# EAGLE design dyno_revA (EAGLE 9.6.2)
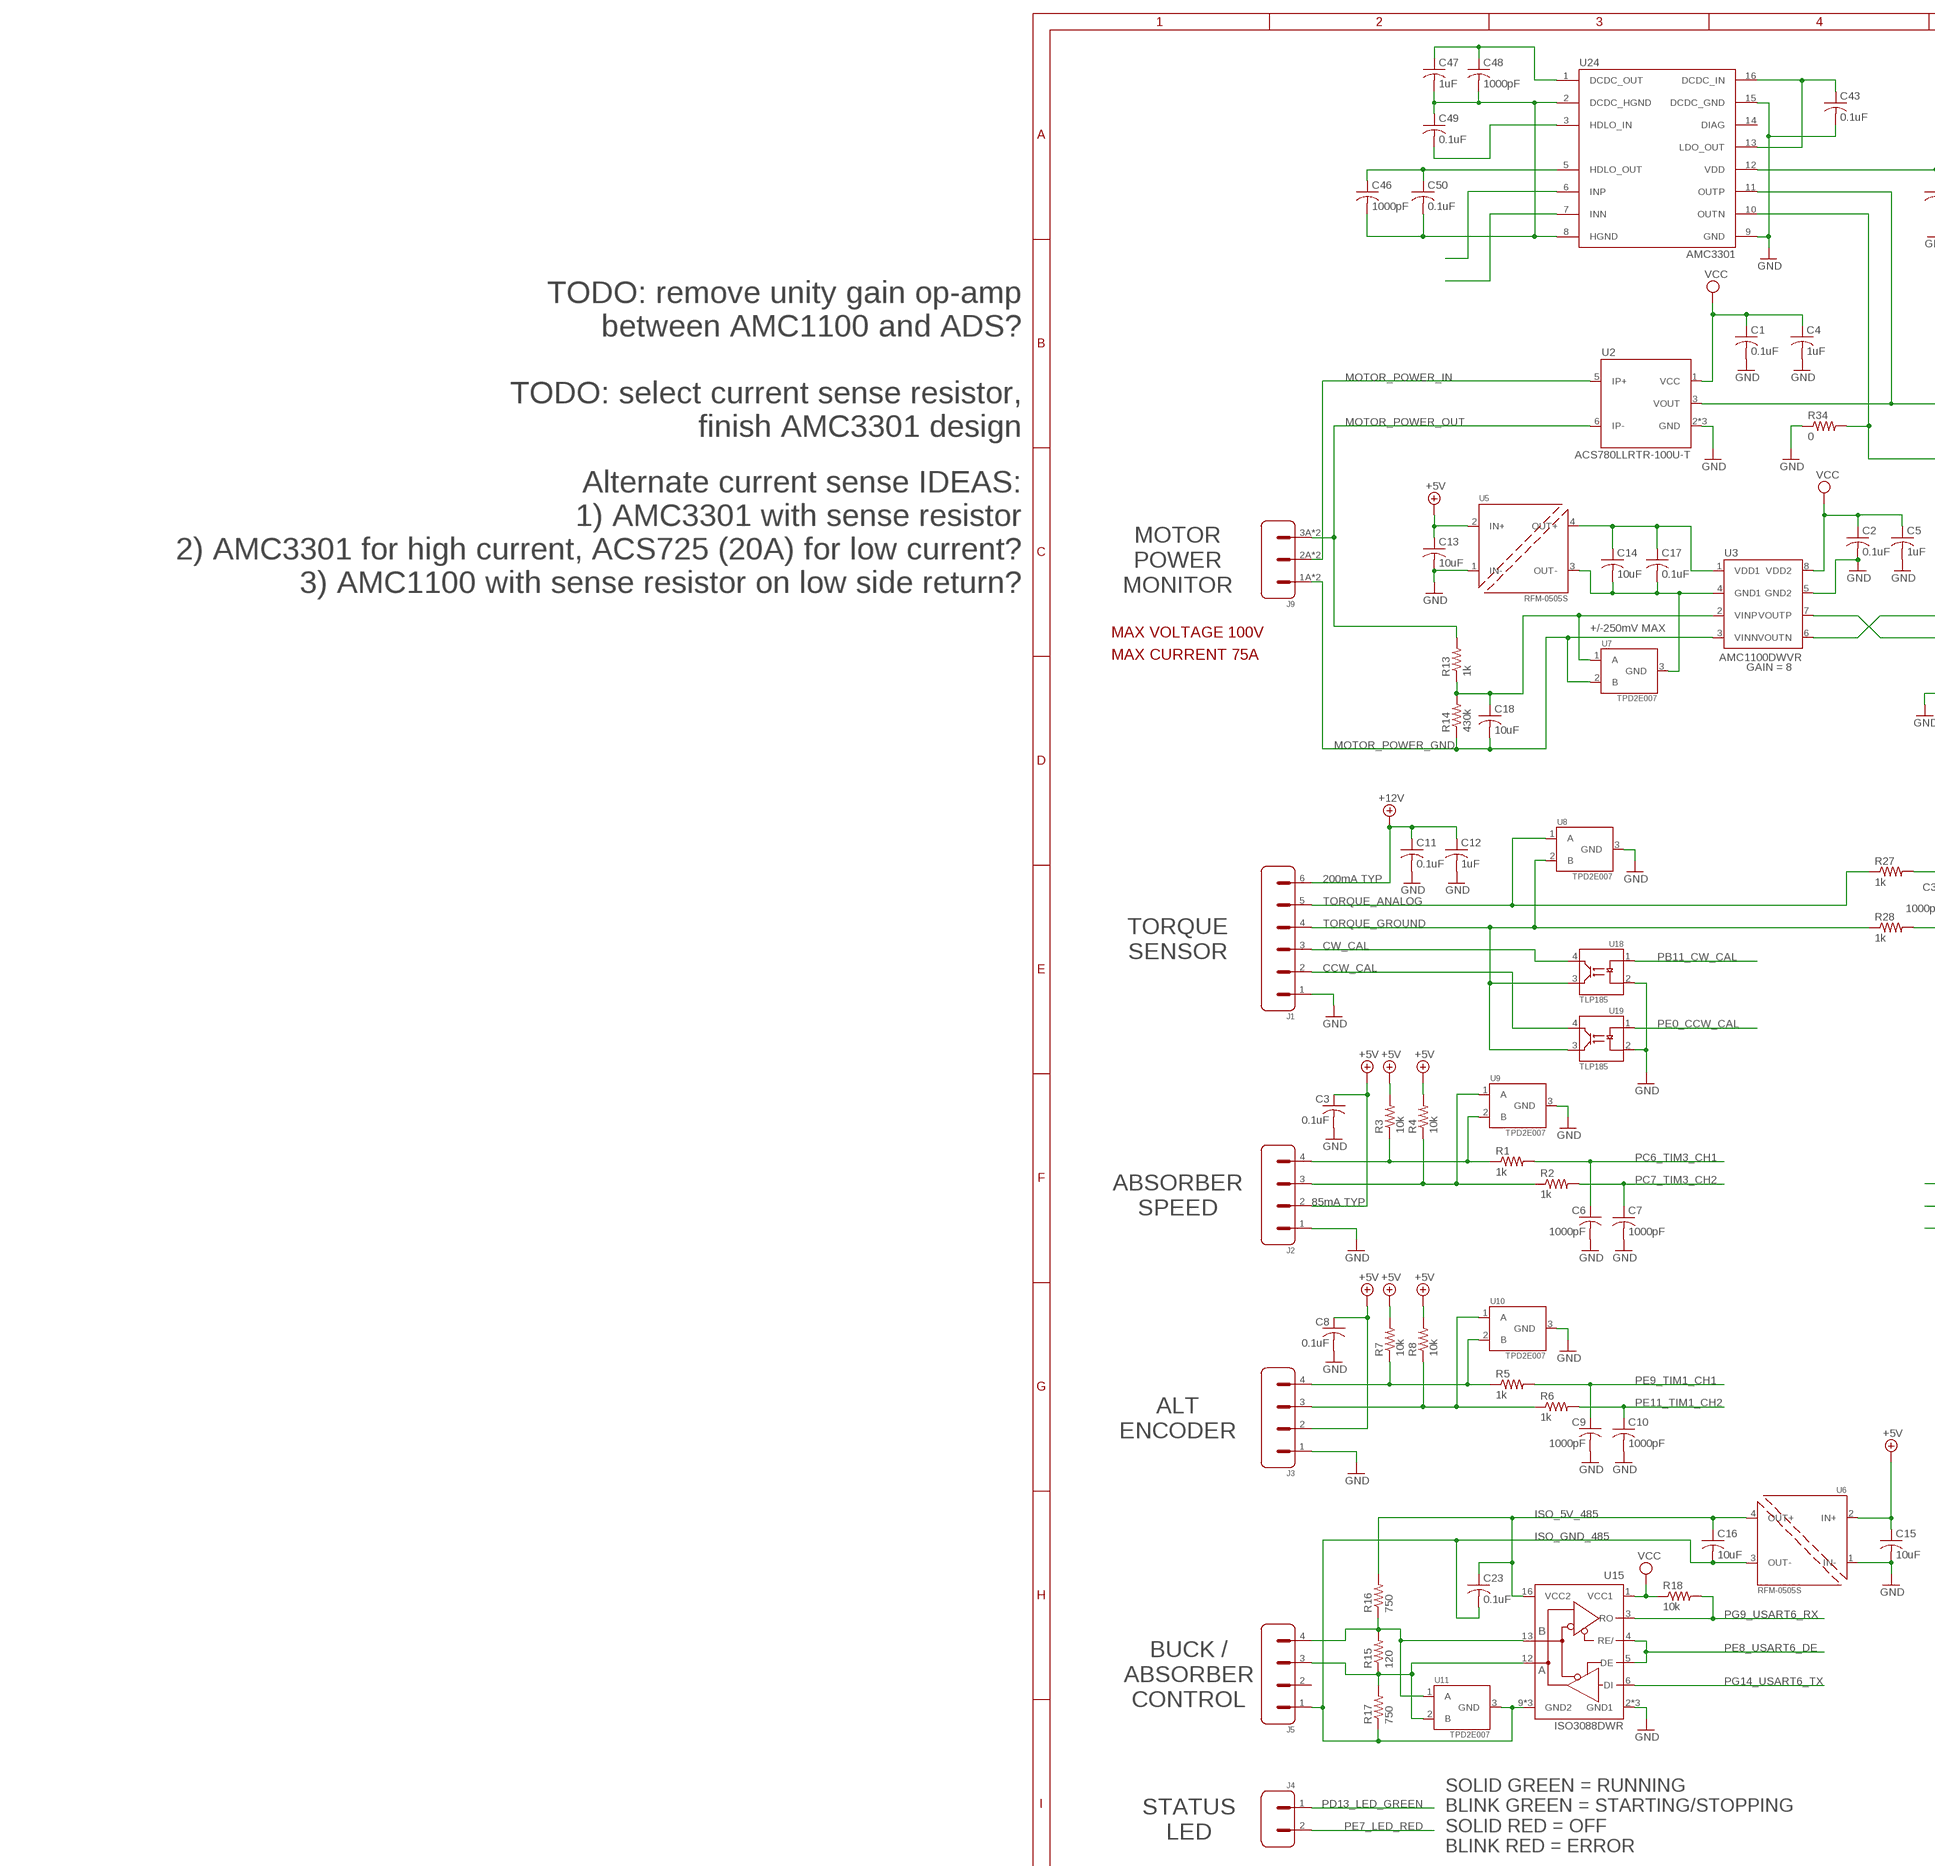
[diagram p0: schematic, sheet 1, part 1 of 2]
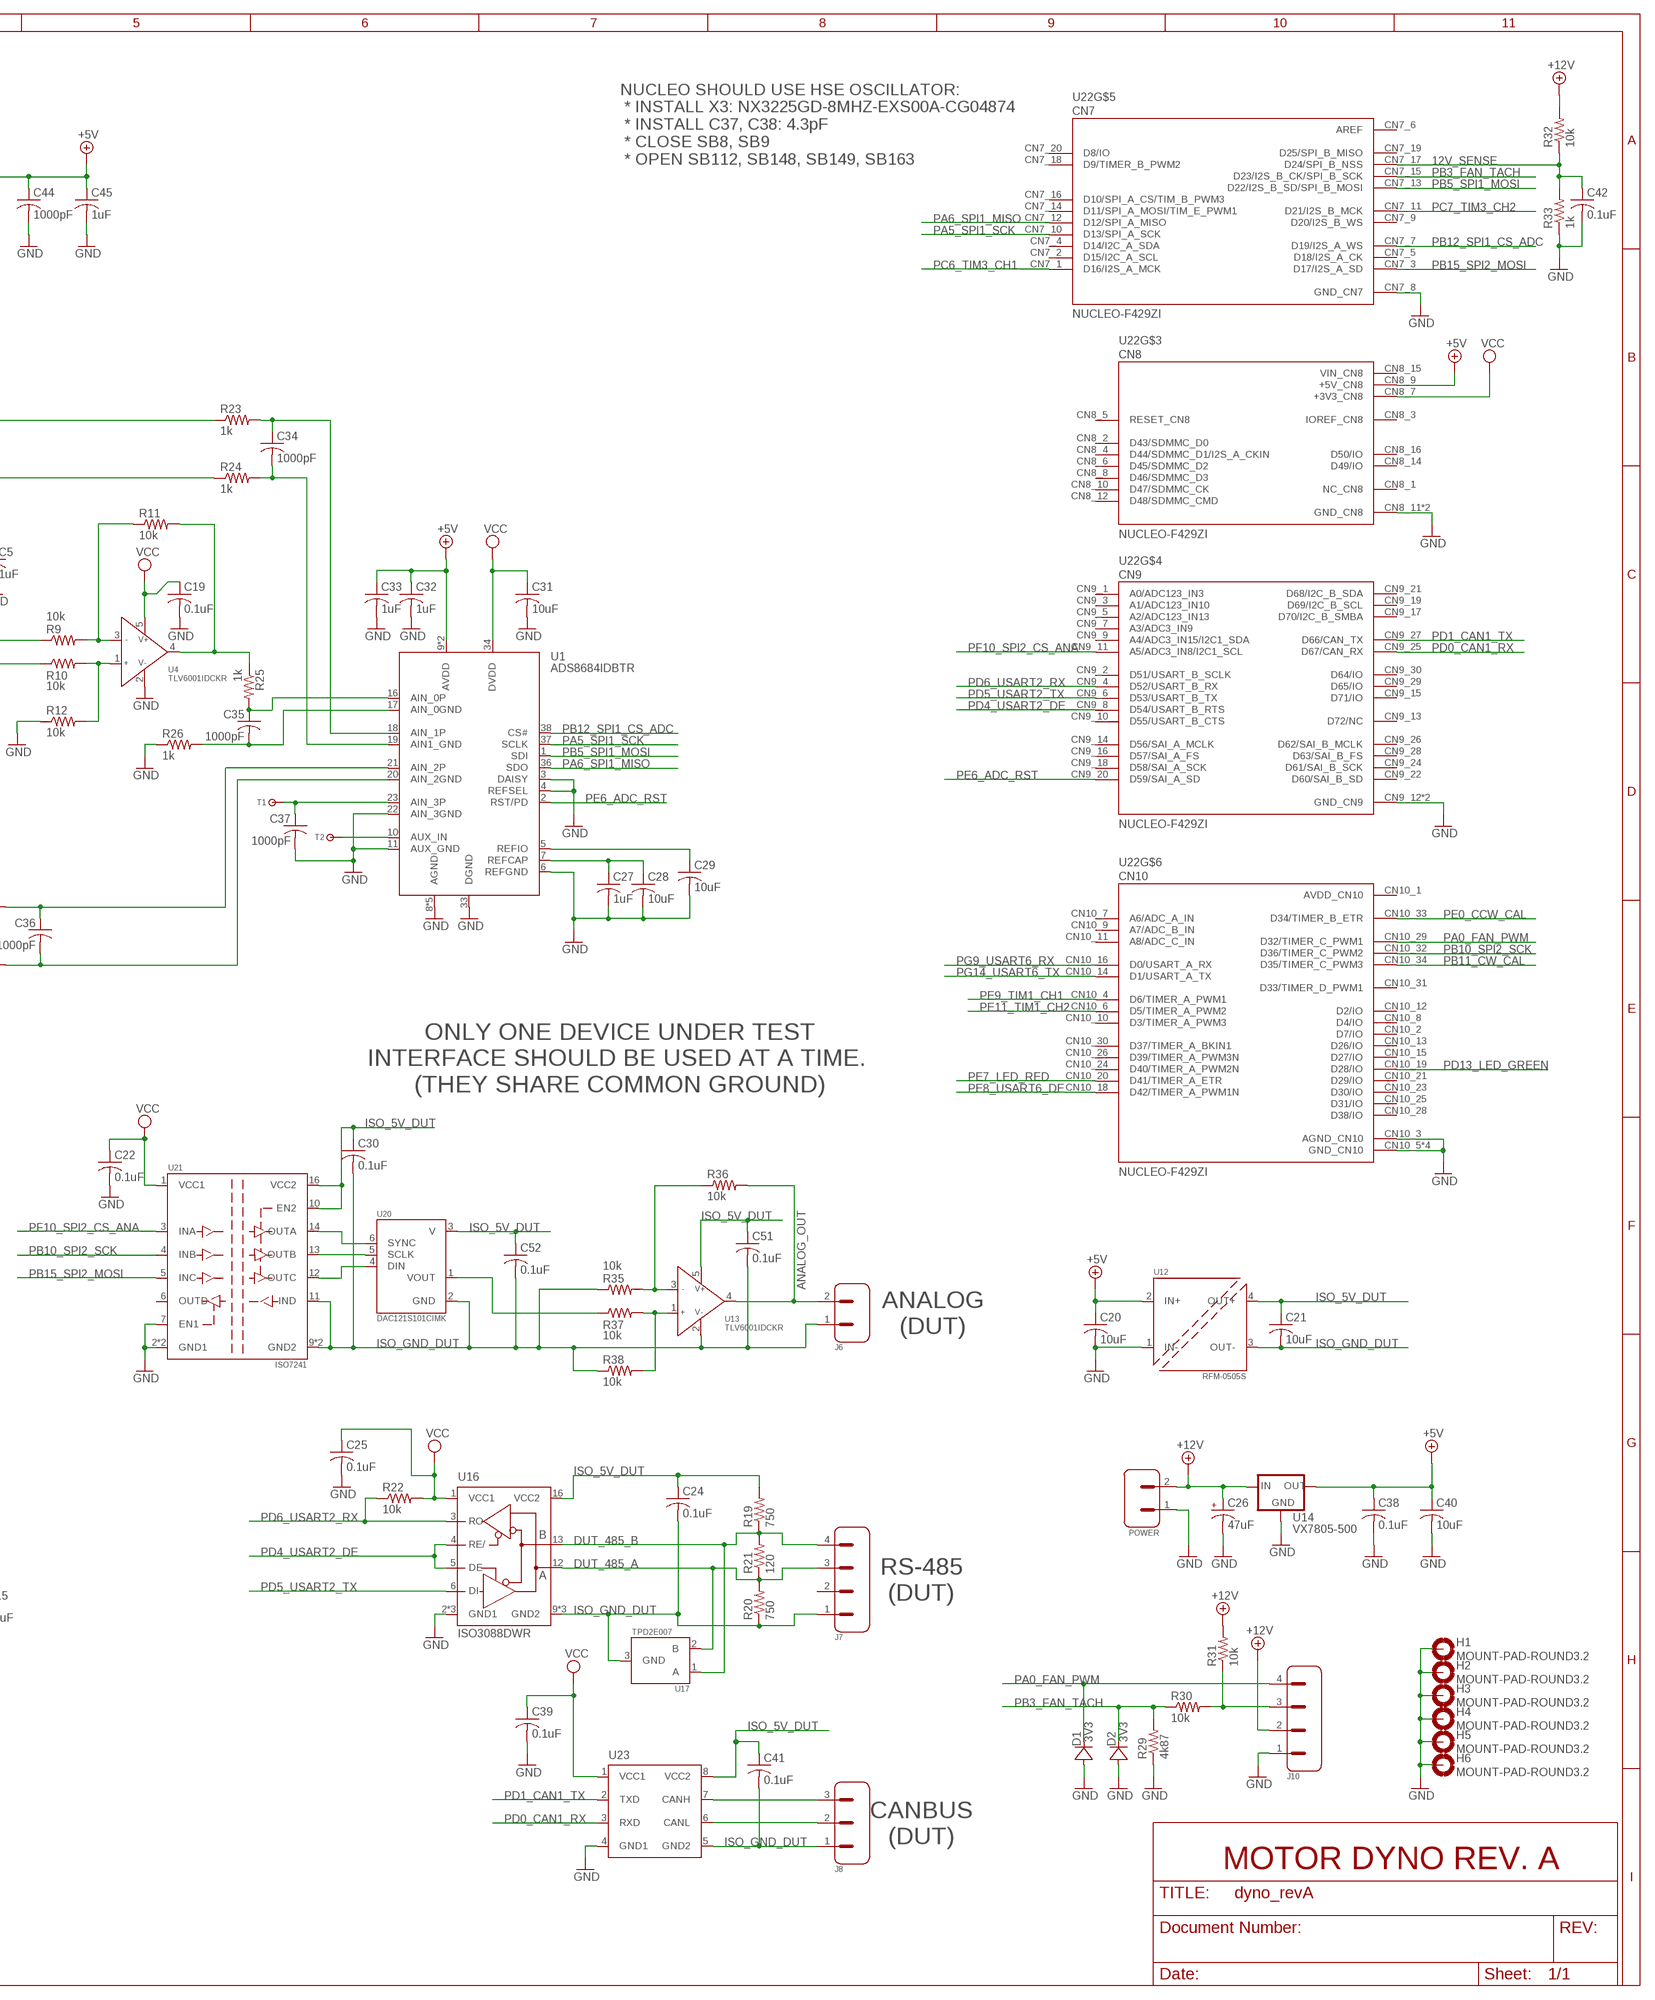
[diagram p1: schematic, sheet 1, part 2 of 2]

## Parts
C1  0.1uF  CL10B104KB8NNNC  [CAPC1608X90(C0603)]
C2  0.1uF  CL10B104KB8NNNC  [CAPC1608X90(C0603)]
C3  0.1uF  CL10B104KB8NNNC  [CAPC1608X90(C0603)]
C4  1uF  CL10A105KB8NNNC  [CAPC1608X90(C0603)]
C5  1uF  CL10A105KB8NNNC  [CAPC1608X90(C0603)]
C6  1000pF  CL10B102KB8NNNC  [CAPC1608X90(C0603)]
C7  1000pF  CL10B102KB8NNNC  [CAPC1608X90(C0603)]
C8  0.1uF  CL10B104KB8NNNC  [CAPC1608X90(C0603)]
C9  1000pF  CL10B102KB8NNNC  [CAPC1608X90(C0603)]
C10  1000pF  CL10B102KB8NNNC  [CAPC1608X90(C0603)]
C11  0.1uF  CL10B104KB8NNNC  [CAPC1608X90(C0603)]
C12  1uF  CL10A105KB8NNNC  [CAPC1608X90(C0603)]
C13  10uF  CL21A106KAYNNNE  [CAPC2012X145]
C14  10uF  CL21A106KAYNNNE  [CAPC2012X145]
C15  10uF  CL21A106KAYNNNE  [CAPC2012X145]
C16  10uF  CL21A106KAYNNNE  [CAPC2012X145]
C17  0.1uF  CL10B104KB8NNNC  [CAPC1608X90(C0603)]
C18  10uF  CL21A106KAYNNNE  [CAPC2012X145]
C19  0.1uF  CL10B104KB8NNNC  [CAPC1608X90(C0603)]
C20  10uF  CL21A106KAYNNNE  [CAPC2012X145]
C21  10uF  CL21A106KAYNNNE  [CAPC2012X145]
C22  0.1uF  CL10B104KB8NNNC  [CAPC1608X90(C0603)]
C23  0.1uF  CL10B104KB8NNNC  [CAPC1608X90(C0603)]
C24  0.1uF  CL10B104KB8NNNC  [CAPC1608X90(C0603)]
C25  0.1uF  CL10B104KB8NNNC  [CAPC1608X90(C0603)]
C26  47uF  HHXA500ARA470MHA0G  [CAPAE830X850(PANA_F)]
C27  1uF  CL10A105KB8NNNC  [CAPC1608X90(C0603)]
C28  10uF  CL10A106KQ8NNNC  [CAPC1608X90(C0603)]
C29  10uF  CL10A106KQ8NNNC  [CAPC1608X90(C0603)]
C30  0.1uF  CL10B104KB8NNNC  [CAPC1608X90(C0603)]
C31  10uF  CL10A106KQ8NNNC  [CAPC1608X90(C0603)]
C32  1uF  CL10A105KB8NNNC  [CAPC1608X90(C0603)]
C33  1uF  CL10A105KB8NNNC  [CAPC1608X90(C0603)]
C34  1000pF  CL10B102KB8NNNC  [CAPC1608X90(C0603)]
C35  1000pF  CL10B102KB8NNNC  [CAPC1608X90(C0603)]
C36  1000pF  CL10B102KB8NNNC  [CAPC1608X90(C0603)]
C37  1000pF  CL10B102KB8NNNC  [CAPC1608X90(C0603)]
C38  0.1uF  CL10B104KB8NNNC  [CAPC1608X90(C0603)]
C39  0.1uF  CL10B104KB8NNNC  [CAPC1608X90(C0603)]
C40  10uF  CL21A106KAYNNNE  [CAPC2012X145]
C41  0.1uF  CL10B104KB8NNNC  [CAPC1608X90(C0603)]
C42  0.1uF  CL10B104KB8NNNC  [CAPC1608X90(C0603)]
C43  0.1uF  CL10B104KB8NNNC  [CAPC1608X90(C0603)]
C44  1000pF  CL10B102KB8NNNC  [CAPC1608X90(C0603)]
C45  1uF  CL10A105KB8NNNC  [CAPC1608X90(C0603)]
C46  1000pF  CL10B102KB8NNNC  [CAPC1608X90(C0603)]
C47  1uF  CL10A105KB8NNNC  [CAPC1608X90(C0603)]
C48  1000pF  CL10B102KB8NNNC  [CAPC1608X90(C0603)]
C49  0.1uF  CL10B104KB8NNNC  [CAPC1608X90(C0603)]
C50  0.1uF  CL10B104KB8NNNC  [CAPC1608X90(C0603)]
C51  0.1uF  CL10B104KB8NNNC  [CAPC1608X90(C0603)]
C52  0.1uF  CL10B104KB8NNNC  [CAPC1608X90(C0603)]
D1  3V3  D1213A-01WS-7  [SOD2513X110(SOD323)]
D2  3V3  D1213A-01WS-7  [SOD2513X110(SOD323)]
H1  MOUNT-PAD-ROUND3.2  [3,2-PAD]
H2  MOUNT-PAD-ROUND3.2  [3,2-PAD]
H3  MOUNT-PAD-ROUND3.2  [3,2-PAD]
H4  MOUNT-PAD-ROUND3.2  [3,2-PAD]
H5  MOUNT-PAD-ROUND3.2  [3,2-PAD]
H6  MOUNT-PAD-ROUND3.2  [3,2-PAD]
J1  502584-0670  [502584-0670]
J2  502584-0470  [502584-0470]
J3  502584-0470  [502584-0470]
J4  502584-0270  [502584-0270]
J5  43650-0416  [43650-0416]
J6  502584-0270  [502584-0270]
J7  43650-0416  [43650-0416]
J8  43650-0316  [43650-0316]
J9  1017532  [1017532]
J10  22-23-2041  [22-23-2041]
POWER  39-29-0023  [5566-2]
R1  1k  ERJ-3EKF1001V  [RESC1608X55(ERJ-0603)]
R2  1k  ERJ-3EKF1001V  [RESC1608X55(ERJ-0603)]
R3  10k  ERJ-3EKF1002V  [RESC1608X55(ERJ-0603)]
R4  10k  ERJ-3EKF1002V  [RESC1608X55(ERJ-0603)]
R5  1k  ERJ-3EKF1001V  [RESC1608X55(ERJ-0603)]
R6  1k  ERJ-3EKF1001V  [RESC1608X55(ERJ-0603)]
R7  10k  ERJ-3EKF1002V  [RESC1608X55(ERJ-0603)]
R8  10k  ERJ-3EKF1002V  [RESC1608X55(ERJ-0603)]
R9  10k  ERJ-3EKF1002V  [RESC1608X55(ERJ-0603)]
R10  10k  ERJ-3EKF1002V  [RESC1608X55(ERJ-0603)]
R11  10k  ERJ-3EKF1002V  [RESC1608X55(ERJ-0603)]
R12  10k  ERJ-3EKF1002V  [RESC1608X55(ERJ-0603)]
R13  1k  ERJ-3EKF1001V  [RESC1608X55(ERJ-0603)]
R14  430k  ERJ-3EKF4303V  [RESC1608X55(ERJ-0603)]
R15  120  ERJ-3EKF1200V  [RESC1608X55(ERJ-0603)]
R16  750  ERJ-3EKF7500V  [RESC1608X55(ERJ-0603)]
R17  750  ERJ-3EKF7500V  [RESC1608X55(ERJ-0603)]
R18  10k  ERJ-3EKF1002V  [RESC1608X55(ERJ-0603)]
R19  750  ERJ-3EKF7500V  [RESC1608X55(ERJ-0603)]
R20  750  ERJ-3EKF7500V  [RESC1608X55(ERJ-0603)]
R21  120  ERJ-3EKF1200V  [RESC1608X55(ERJ-0603)]
R22  10k  ERJ-3EKF1002V  [RESC1608X55(ERJ-0603)]
R23  1k  ERJ-3EKF1001V  [RESC1608X55(ERJ-0603)]
R24  1k  ERJ-3EKF1001V  [RESC1608X55(ERJ-0603)]
R25  1k  ERJ-3EKF1001V  [RESC1608X55(ERJ-0603)]
R26  1k  ERJ-3EKF1001V  [RESC1608X55(ERJ-0603)]
R27  1k  ERJ-3EKF1001V  [RESC1608X55(ERJ-0603)]
R28  1k  ERJ-3EKF1001V  [RESC1608X55(ERJ-0603)]
R29  4k87  ERJ-3EKF4871V  [RESC1608X55(ERJ-0603)]
R30  10k  ERJ-3EKF1002V  [RESC1608X55(ERJ-0603)]
R31  10k  ERJ-3EKF1002V  [RESC1608X55(ERJ-0603)]
R32  10k  ERJ-3EKF1002V  [RESC1608X55(ERJ-0603)]
R33  1k  ERJ-3EKF1001V  [RESC1608X55(ERJ-0603)]
R34  0  ERJ-S030  [RESC1608X55(ERJ-0603)]
R35  10k  ERJ-3EKF1002V  [RESC1608X55(ERJ-0603)]
R36  10k  ERJ-3EKF1002V  [RESC1608X55(ERJ-0603)]
R37  10k  ERJ-3EKF1002V  [RESC1608X55(ERJ-0603)]
R38  10k  ERJ-3EKF1002V  [RESC1608X55(ERJ-0603)]
T1  TESTPAD  [TEST]
T2  TESTPAD  [TEST]
U1  ADS8684IDBTR  [SOP50P640X120-38]
U2  ACS780LLRTR-100U-T  [ACS780]
U3  AMC1100DWVR  [SOIC127P1150X280-8]
U4  TLV6001IDCKR  [SOT65P210X110-5]
U5  RFM-0505S  [RFM]
U6  RFM-0505S  [RFM]
U7  TPD2E007  [SOT65P210X110-3(SOT323)]
U8  TPD2E007  [SOT65P210X110-3(SOT323)]
U9  TPD2E007  [SOT65P210X110-3(SOT323)]
U10  TPD2E007  [SOT65P210X110-3(SOT323)]
U11  TPD2E007  [SOT65P210X110-3(SOT323)]
U12  RFM-0505S  [RFM]
U13  TLV6001IDCKR  [SOT65P210X110-5]
U14  VX7805-500  [VX78-500]
U15  ISO3088DWR  [SOIC127P1030X265-16]
U16  ISO3088DWR  [SOIC127P1030X265-16]
U17  TPD2E007  [SOT65P210X110-3(SOT323)]
U18  TLP185  [SOT127P700X220-4]
U19  TLP185  [SOT127P700X220-4]
U20  DAC121S101CIMK  [SOT95P280X110-6]
U21  ISO7241  [SOIC127P1030X265-16]
U22  NUCLEO-F429ZI  [MODULE_NUCLEO-F429ZI]
U23  ISO1042DWVR  [SOIC127P1150X265-8N]
U24  AMC3301  [SOIC127P1030X265-16N]

## Nets
12V_SENSE: C42.1 R32.1 R33.2 U22.CN7_17(D24/SPI_B_NSS)
+5V: C3.1 C8.1 C13.1 C15.1 C20.1 C32.1 C33.1 C38.1 C40.1 C44.1 C45.1 J2.2 J3.2 R3.2 R4.2 R7.2 R8.2 U1.9(AVDD) U1.30(AVDD) U5.2(IN+) U6.2(IN+) U12.2(IN+) U14.3(OUT) U22.CN8_9(+5V_CN8) U24.12(VDD)
+12V: C11.1 C12.1 C26.1(+) J1.6 J10.2 POWER.2 R31.2 R32.2 U14.1(IN)
ABSORBER_485_A: J5.3 R15.1 R17.2 U11.2(B) U15.12(A)
ABSORBER_485_B: J5.4 R15.2 R16.1 U11.1(A) U15.13(B)
AIN_3P: C37.1 T1.T U1.23(AIN_3P)
ANALOG_OUT: J6.2 R36.2 U13.4(OUT)
AUX_IN: T2.T U1.10(AUX_IN)
CANH: J8.3 U23.7(CANH)
CANL: J8.2 U23.6(CANL)
CCW_CAL: J1.2 U19.4(COLL)
CW_CAL: J1.3 U18.4(COLL)
DUT_485_A: J7.3 R20.2 R21.1 U16.12(A) U17.2(B)
DUT_485_B: J7.4 R19.1 R21.2 U16.13(B) U17.1(A)
ENC_A: J3.4 R5.1 R7.1 U10.2(B)
ENC_B: J3.3 R6.1 R8.1 U10.1(A)
GND: C1.2 C2.2 C3.2 C4.2 C5.2 C6.2 C7.2 C8.2 C9.2 C10.2 C11.2 C12.2 C13.2 C15.2 C19.2 C20.2 C22.2 C25.2 C26.2(-) C27.2 C28.2 C29.2 C31.2 C32.2 C33.2 C37.2 C38.2 C39.2 C40.2 C42.2 C43.2 C44.2 C45.2 D1.2(A) D2.2(A) H1.B3,2(MOUNT) H2.B3,2(MOUNT) H3.B3,2(MOUNT) H4.B3,2(MOUNT) H5.B3,2(MOUNT) H6.B3,2(MOUNT) J1.1 J2.1 J3.1 J10.1 POWER.1 R12.1 R26.1 R29.1 R33.1 R34.1 U1.3(DAISY) U1.4(REFSEL) U1.6(REFGND) U1.8(AGND) U1.11(AUX_GND) U1.22(AIN_3GND) U1.28(AGND) U1.29(AGND) U1.31(AGND) U1.32(AGND) U1.33(DGND) U2.2(GND) U2.4(GND) U2.7(GND) U3.5(GND2) U4.2(V-) U5.1(IN-) U6.1(IN-) U8.3(GND) U9.3(GND) U10.3(GND) U12.1(IN-) U14.2(GND) U15.2(GND1) U15.7(GND1) U15.8(GND1) U16.2(GND1) U16.7(GND1) U16.8(GND1) U18.2(C) U19.2(C) U21.2(GND1) U21.7(EN1) U21.8(GND1) U22.CN7_8(GND_CN7) U22.CN8_11(GND_CN8) U22.CN8_13(GND_CN8) U22.CN9_12(GND_CN9) U22.CN9_23(GND_CN9) U22.CN10_3(AGND_CN10) U22.CN10_5(GND_CN10) U22.CN10_17(GND_CN10) U22.CN10_22(GND_CN10) U22.CN10_27(GND_CN10) U23.4(GND1) U24.9(GND) U24.15(DCDC_GND)
ISENSE_OUT: R23.1 U2.3(VOUT) U24.11(OUTP)
ISO_5V_485: C16.1 C23.1 R16.2 U6.4(OUT+) U15.16(VCC2)
ISO_5V_DUT: C21.1 C24.1 C30.1 C41.1 C51.1 C52.1 R19.2 U12.4(OUT+) U13.5(V+) U16.16(VCC2) U20.3(V) U21.10(EN2) U21.16(VCC2) U23.8(VCC2)
ISO_5V_M: C14.1 C17.1 U3.1(VDD1) U5.4(OUT+)
ISO_GND_485: C16.2 C23.2 J5.1 R17.1 U6.3(OUT-) U11.3(GND) U15.9(GND2) U15.10(GND2) U15.15(GND2)
ISO_GND_DUT: C21.2 C24.2 C30.2 C41.2 C51.2 C52.2 J6.1 J7.1 J8.1 R20.1 R35.1 R38.1 U12.3(OUT-) U13.2(V-) U16.9(GND2) U16.10(GND2) U16.15(GND2) U17.3(GND) U20.2(GND) U21.9(GND2) U21.11(IND) U21.15(GND2) U23.5(GND2)
ISO_GND_M: C14.2 C17.2 U3.4(GND1) U5.3(OUT-) U7.3(GND)
MOTOR_POWER_GND: C18.2 J9.1A J9.1B R14.1 U3.3(VINN) U7.2(B)
MOTOR_POWER_IN: J9.2A J9.2B U2.5(IP+)
MOTOR_POWER_OUT: J9.3A J9.3B R13.2 U2.6(IP-)
N$1: J10.3 R30.2 R31.1
N$2: C43.1 U24.13(LDO_OUT) U24.16(DCDC_IN)
N$3: R10.2 R12.2 U4.1(+)
N$4: R9.2 R11.1 U4.3(-)
N$5: R24.1 R34.2 U24.10(OUTN)
N$6: C35.2 R26.2 U1.17(AIN_0GND)
N$7: U24.6(INP)
N$8: U24.7(INN)
N$9: C35.1 R25.2 U1.16(AIN_0P)
N$10: R10.1 U3.7(VOUTP)
N$11: R37.1 U20.1(VOUT)
N$12: U20.6(SYNC) U21.14(OUTA)
N$13: U20.5(SCLK) U21.13(OUTB)
N$14: U20.4(DIN) U21.12(OUTC)
N$15: R9.1 U3.6(VOUTN)
N$16: C34.1 R23.2 U1.18(AIN_1P)
N$17: C34.2 R24.2 U1.19(AIN1_GND)
N$18: C46.1 C50.1 U24.5(HDLO_OUT)
N$19: C46.2 C47.2 C48.2 C49.1 C50.2 U24.2(DCDC_HGND) U24.8(HGND)
N$20: C47.1 C48.1 U24.1(DCDC_OUT)
N$21: C49.2 U24.3(HDLO_IN)
N$22: R37.2 R38.2 U13.1(+)
N$23: R35.2 R36.1 U13.3(-)
PA0_FAN_PWM: D1.1(C) J10.4 U22.CN10_29(D32/TIMER_C_PWM1)
PA5_SPI1_SCK: U1.37(SCLK) U22.CN7_10(D13/SPI_A_SCK)
PA6_SPI1_MISO: U1.36(SDO) U22.CN7_12(D12/SPI_A_MISO)
PB3_FAN_TACH: D2.1(C) R29.2 R30.1 U22.CN7_15(D23/I2S_B_CK/SPI_B_SCK)
PB5_SPI1_MOSI: U1.1(SDI) U22.CN7_13(D22/I2S_B_SD/SPI_B_MOSI)
PB10_SPI2_SCK: U21.4(INB) U22.CN10_32(D36/TIMER_C_PWM2)
PB11_CW_CAL: U18.1(A) U22.CN10_34(D35/TIMER_C_PWM3)
PB12_SPI1_CS_ADC: U1.38(CS#) U22.CN7_7(D19/I2S_A_WS)
PB15_SPI2_MOSI: U21.5(INC) U22.CN7_3(D17/I2S_A_SD)
PC6_TIM3_CH1: C6.1 R1.2 U22.CN7_1(D16/I2S_A_MCK)
PC7_TIM3_CH2: C7.1 R2.2 U22.CN7_11(D21/I2S_B_MCK)
PD0_CAN1_RX: U22.CN9_25(D67/CAN_RX) U23.3(RXD)
PD1_CAN1_TX: U22.CN9_27(D66/CAN_TX) U23.2(TXD)
PD4_USART2_DE: U16.4(RE/) U16.5(DE) U22.CN9_8(D54/USART_B_RTS)
PD5_USART2_TX: U16.6(DI) U22.CN9_6(D53/USART_B_TX)
PD6_USART2_RX: R22.1 U16.3(RO) U22.CN9_4(D52/USART_B_RX)
PD13_LED_GREEN: J4.1 U22.CN10_19(D28/IO)
PE0_CCW_CAL: U19.1(A) U22.CN10_33(D34/TIMER_B_ETR)
PE6_ADC_RST: U1.2(RST/PD) U22.CN9_20(D59/SAI_A_SD)
PE7_LED_RED: J4.2 U22.CN10_20(D41/TIMER_A_ETR)
PE8_USART6_DE: U15.4(RE/) U15.5(DE) U22.CN10_18(D42/TIMER_A_PWM1N)
PE9_TIM1_CH1: C9.1 R5.2 U22.CN10_4(D6/TIMER_A_PWM1)
PE11_TIM1_CH2: C10.1 R6.2 U22.CN10_6(D5/TIMER_A_PWM2)
PF10_SPI2_CS_ANA: U21.3(INA) U22.CN9_11(A5/ADC3_IN8/I2C1_SCL)
PG9_USART6_RX: R18.2 U15.3(RO) U22.CN10_16(D0/USART_A_RX)
PG14_USART6_TX: U15.6(DI) U22.CN10_14(D1/USART_A_TX)
REFCAP: C27.1 C28.1 U1.7(REFCAP)
REFIO: C29.1 U1.5(REFIO)
SENSE_VOLTAGE: C18.1 R13.1 R14.2 U3.2(VINP) U7.1(A)
SPEED_A: J2.4 R1.1 R3.1 U9.2(B)
SPEED_B: J2.3 R2.1 R4.1 U9.1(A)
TAF: C36.1 R27.2 U1.21(AIN_2P)
TGF: C36.2 R28.2 U1.20(AIN_2GND)
TORQUE_ANALOG: J1.5 R27.1 U8.1(A)
TORQUE_GROUND: J1.4 R28.1 U8.2(B) U18.3(EMIT) U19.3(EMIT)
VCC: C1.1 C2.1 C4.1 C5.1 C19.1 C22.1 C25.1 C31.1 C39.1 R18.1 R22.2 U1.34(DVDD) U2.1(VCC) U3.8(VDD2) U4.5(V+) U15.1(VCC1) U16.1(VCC1) U21.1(VCC1) U22.CN8_7(+3V3_CN8) U23.1(VCC1)
VSENSE_OUT: R11.2 R25.1 U4.4(OUT)
Unconnected: J5.2 J7.2 U21.6(OUTD) U22.CN7_2(D15/I2C_A_SCL) U22.CN7_4(D14/I2C_A_SDA) U22.CN7_5(D18/I2S_A_CK) U22.CN7_9(D20/I2S_B_WS) U22.CN7_14(D11/SPI_A_MOSI/TIM_E_PWM1) U22.CN7_16(D10/SPI_A_CS/TIM_B_PWM3) U22.CN7_18(D9/TIMER_B_PWM2) U22.CN7_19(D25/SPI_B_MISO) U22.CN7_20(D8/IO) U22.CN8_1(NC_CN8) U22.CN8_2(D43/SDMMC_D0) U22.CN8_3(IOREF_CN8) U22.CN8_4(D44/SDMMC_D1/I2S_A_CKIN) U22.CN8_5(RESET_CN8) U22.CN8_6(D45/SDMMC_D2) U22.CN8_8(D46/SDMMC_D3) U22.CN8_10(D47/SDMMC_CK) U22.CN8_12(D48/SDMMC_CMD) U22.CN8_14(D49/IO) U22.CN8_16(D50/IO) U22.CN9_1(A0/ADC123_IN3) U22.CN9_2(D51/USART_B_SCLK) U22.CN9_3(A1/ADC123_IN10) U22.CN9_5(A2/ADC123_IN13) U22.CN9_7(A3/ADC3_IN9) U22.CN9_9(A4/ADC3_IN15/I2C1_SDA) U22.CN9_10(D55/USART_B_CTS) U22.CN9_13(D72/NC) U22.CN9_14(D56/SAI_A_MCLK) U22.CN9_15(D71/IO) U22.CN9_16(D57/SAI_A_FS) U22.CN9_17(D70/I2C_B_SMBA) U22.CN9_18(D58/SAI_A_SCK) U22.CN9_19(D69/I2C_B_SCL) U22.CN9_21(D68/I2C_B_SDA) U22.CN9_22(D60/SAI_B_SD) U22.CN9_24(D61/SAI_B_SCK) U22.CN9_26(D62/SAI_B_MCLK) U22.CN9_28(D63/SAI_B_FS) U22.CN9_29(D65/IO) U22.CN9_30(D64/IO) U22.CN10_2(D7/IO) U22.CN10_7(A6/ADC_A_IN) U22.CN10_8(D4/IO) U22.CN10_9(A7/ADC_B_IN) U22.CN10_10(D3/TIMER_A_PWM3) U22.CN10_11(A8/ADC_C_IN) U22.CN10_12(D2/IO) U22.CN10_13(D26/IO) U22.CN10_15(D27/IO) U22.CN10_21(D29/IO) U22.CN10_23(D30/IO) U22.CN10_24(D40/TIMER_A_PWM2N) U22.CN10_25(D31/IO) U22.CN10_26(D39/TIMER_A_PWM3N) U22.CN10_28(D38/IO) U22.CN10_30(D37/TIMER_A_BKIN1) U22.CN10_31(D33/TIMER_D_PWM1) U24.14(DIAG)

## Notes on the sheet
- NUCLEO SHOULD USE HSE OSCILLATOR:
   * INSTALL X3: NX3225GD-8MHZ-EXS00A-CG04874
   * INSTALL C37, C38: 4.3pF
   * CLOSE SB8, SB9
   * OPEN SB112, SB148, SB149, SB163
- TODO: remove unity gain op-amp
  between AMC1100 and ADS?
- TODO: select current sense resistor,
  finish AMC3301 design
- Alternate current sense IDEAS:
  1) AMC3301 with sense resistor
  2) AMC3301 for high current, ACS725 (20A) for low current?
  3) AMC1100 with sense resistor on low side return?
- MOTOR
  POWER
  MONITOR
- +/-250mV MAX
- MAX VOLTAGE 100V
- MAX CURRENT 75A
- GAIN = 8
- 200mA TYP
- TORQUE
  SENSOR
- ONLY ONE DEVICE UNDER TEST
  INTERFACE SHOULD BE USED AT A TIME. 
  (THEY SHARE COMMON GROUND)
- ABSORBER
  SPEED
- 85mA TYP
- ANALOG
  (DUT)
- ALT
  ENCODER
- RS-485
  (DUT)
- BUCK /
  ABSORBER
  CONTROL
- CANBUS
  (DUT)
- MOTOR DYNO REV. A
- STATUS
  LED
- SOLID GREEN = RUNNING
  BLINK GREEN = STARTING/STOPPING
  SOLID RED = OFF
  BLINK RED = ERROR

## Power pins joined to a net without a drawn wire
AREF: U22.CN7_6(AREF)
AVDD_CN10: U22.CN10_1(AVDD_CN10)
VIN_CN8: U22.CN8_15(VIN_CN8)

## Library data of the parts
C1-C3 C6-C11 C17 C19 C22-C25 C30 C34-C39 C41-C44 C46 C48-C52 = botnuvo:CL10: CAP CER, 0603; GRADE: X7R; VOLTAGE: 50V
C4 C5 C12 C27 C32 C33 C45 C47 = botnuvo:CL10: CAP CER, 0603; GRADE: X5R; VOLTAGE: 50V
C13-C16 C18 C20 C21 C40 = botnuvo:CL21: CAP CER, 0805; GRADE: X5R; VOLTAGE: 25V
C26 = botnuvo:HHXA500ARA470MHA0G: CAP ALUM POLY HYB 47UF 50V SMD TESTED: NO (NEW 3D FOOTPRINT)
C28 C29 C31 = botnuvo:CL10: CAP CER, 0603; GRADE: X5R; VOLTAGE: 6.3V
D1 D2 = botnuvo:D1213A-01WS-7: TVS DIODE 3.3V 10V SOD323 TESTED: NO
H1-H6 = holes:MOUNT-PAD-ROUND: MOUNTING PAD, round
J1 = botnuvo:502584-0670: CLIK-MATE HEADER VERT 6POS 1.50MM TESTED: YES
J2 J3 = botnuvo:502584-0470: CLIK-MATE HEADER VERT 4POS 1.50MM TESTED: NO
J4 J6 = botnuvo:502584-0270: CLIK-MATE HEADER VERT 2POS 1.50MM TESTED: NO
J5 J7 = botnuvo:43650-0416: MICROFIT HEADER 4POS 3MM VERT GOLD TESTED: YES
J8 = botnuvo:43650-0316: MICROFIT HEADER 3POS 3MM VERT GOLD TESTED: NO
J9 = botnuvo:1017532: TERMINAL BLOCK, 3P 600V, 58A, 6-20AWG TESTED: NO
J10 = botnuvo:22-23-2041: KK HEADER VERT 4POS 2.54MM TESTED: NO
POWER = botnuvo:39-29-0023: MINIFIT JR HEADER 2POS VERT GOLD TESTED: NO
R1-R33 R35-R38 = botnuvo:ERJ-3EKF: RES SMD OHM 1% 1/10W 0603
R34 = botnuvo:ERJ-S030
T1 T2 = fergs:TESTPAD
U1 = botnuvo:ADS8684: IC ADC 16BIT 500KSPS 38TSSOP
U2 = botnuvo:ACS780: CURRENT SENSOR
U3 = botnuvo:AMC1100: IC OPAMP ISOLATION 100KHZ 8SOIC
U4 U13 = botnuvo:TLV6001: IC OP AMP RR 1MHZ SC70-5
U5 U6 U12 = botnuvo:RFM-0505S: DC DC CONVERTER 5V 1W (ISOLATED)
U7-U11 U17 = botnuvo:TPD2E007: 2 CHANNEL ESD PROTECTION
U14 = botnuvo:VX780: SWITCHING REGULATOR; CURRENT: 500mA; VIN: 6.5-36V; VOUT: 5V
U15 U16 = botnuvo:ISO3088: IC ISOLATED RS422/RS485 16SOIC
U18 U19 = botnuvo:TLP185: OPTOISO 3.75KV TRANS 6-SO 4 LEAD
U20 = botnuvo:DAC121: IC DAC 12BIT MICROPWR 6SOT
U21 = botnuvo:ISO7241: IC ISOLATOR 2.5KV 3OUT/1IN 16SOIC
U22 = NUCLEO-F429ZI:NUCLEO-F429ZI: STM32F429ZI, mbed-Enabled Development Nucleo-144 STM32F4 ARM® Cortex®-M4 MCU 32-Bit Embedded Evaluation Board Check prices <https://pricing.snapeda.com/parts/NUCLEO-F429ZI/STMicroelectronics/view-part?ref=eda>; AVAILABILITY: Warning; DESCRIPTION: STM32F429ZI, mbed-Enabled Development Nucleo-144 STM32F4 ARM® Cortex®-M4 MCU 32-Bit Embedded Evaluation Board; MF: STMicroelectronics; MP: NUCLEO-F429ZI; PACKAGE: None; PRICE: None; PURCHASE-URL: https://pricing.snapeda.com/search/part/NUCLEO-F429ZI/?ref=eda
U23 = botnuvo:ISO1042: ISOLATED CAN, 8SOIC TESTED: NO
U24 = botnuvo:AMC3301

## Board
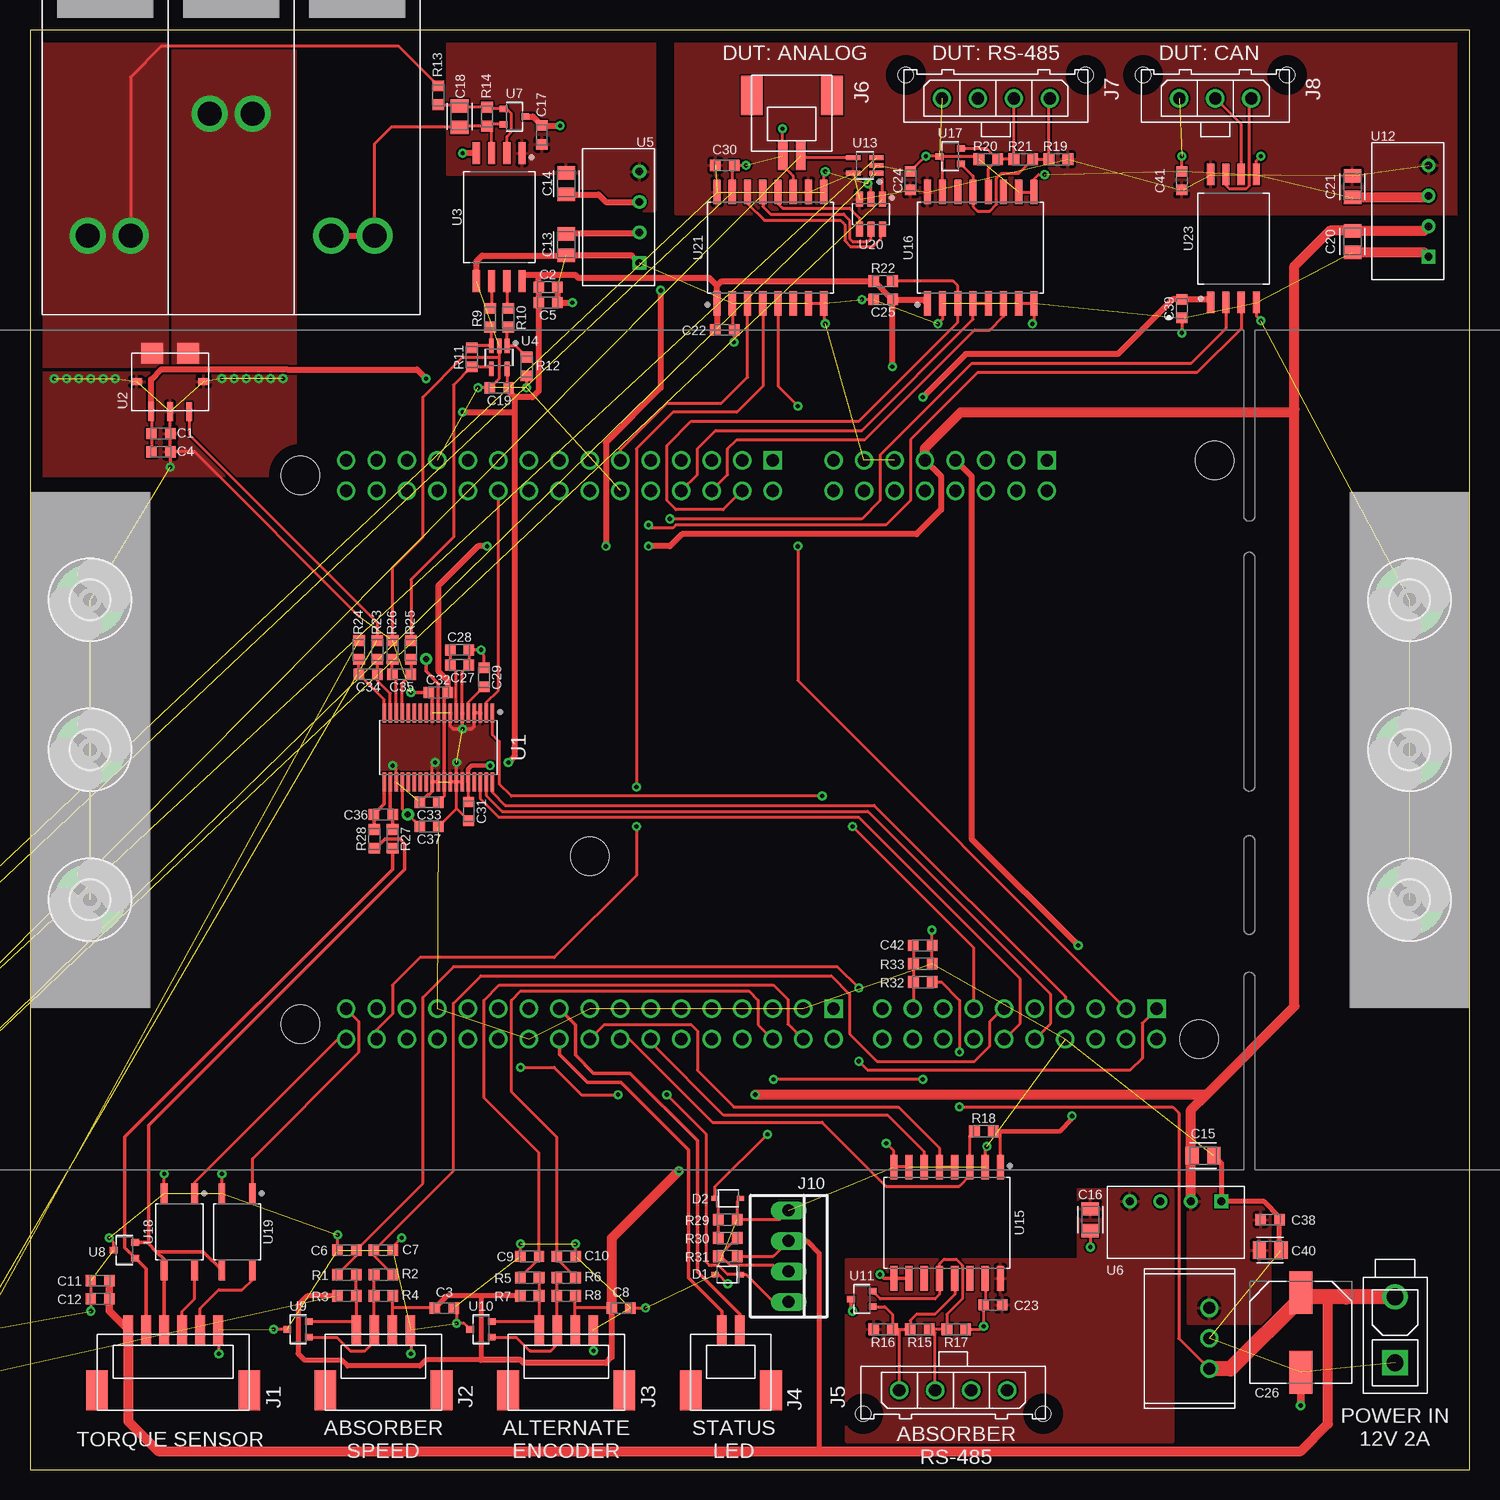
[diagram p2: board, top side]
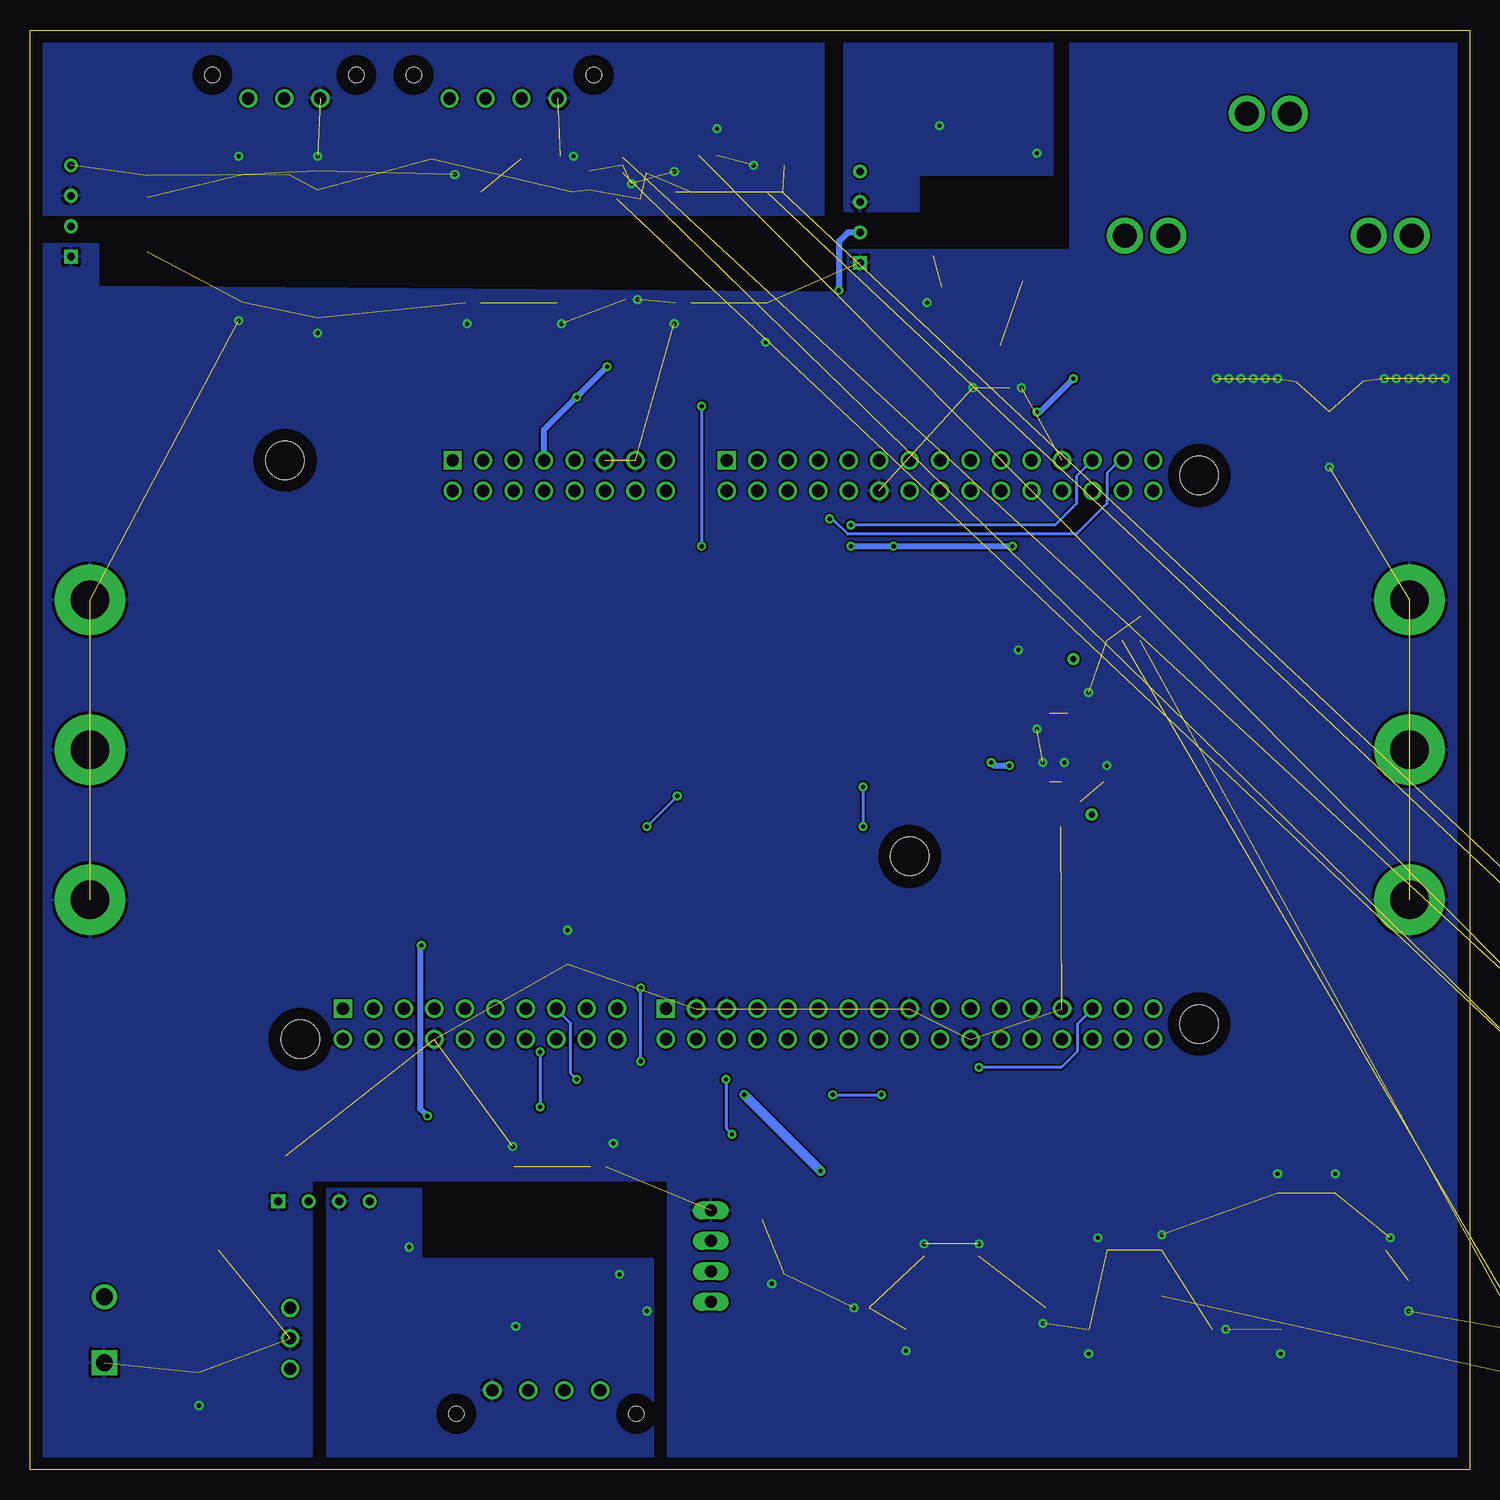
[diagram p3: board, bottom side, seen from below]

Size 120 x 120 mm. Coordinates in mm from the lower left corner, seen from the top.
Outline: 0,0 120,0 120,120 0,120 0,0
Copper layers (1*16): Top 0.035mm / dielectric 1.5mm / Bottom 0.035mm
Design rules "default": minimum track width 6mil, minimum drill 0.35mm, track to track 6mil, track to pad 6mil, pad to pad 6mil, via to via 6mil, smd to smd 6mil, copper to edge 40mil, drill to drill 6mil, minimum pad ring 10mil, minimum via ring 8mil, stop-mask expansion 4mil, vias tented up to drill 0mil, thermal gap 10mil

### Footprints (pad centres in the part's own frame; a part is rotated, then mirrored left to right if it is on the bottom)
CAPC1608X90(C0603) = smd 0.87 x 0.929: 1 -0.78,0; 2 0.78,0
CAPC2012X145 = smd 1.115 x 1.465: 1 -0.9,0; 2 0.9,0
CAPAE830X850(PANA_F) = smd 3.565 x 1.915: 1 -3.325,0; 2 3.325,0
SOD2513X110(SOD323) = smd 0.59 x 0.45: 1 -1.05,0; 2 1.05,0
3,2-PAD = drill 3.2 pad 5.842: B3,2 0,0
502584-0670 = smd 0.8 x 2.4: 1 3.75,5.05; 2 2.25,5.05; 3 0.75,5.05; 4 -0.75,5.05; 5 -2.25,5.05; 6 -3.75,5.05 | smd 1.8 x 3.3: P$5 -6.35,0; P$6 6.35,0
502584-0470 = smd 0.8 x 2.4: 1 2.25,5.05; 2 0.75,5.05; 3 -0.75,5.05; 4 -2.25,5.05 | smd 1.8 x 3.3: P$5 -4.85,0; P$6 4.85,0
502584-0270 = smd 0.8 x 2.4: 1 0.75,5.05; 2 -0.75,5.05 | smd 1.8 x 3.3: P$5 -3.35,0; P$6 3.35,0
43650-0416 = drill 1.02: 1 4.5,0; 2 1.5,0; 3 -1.5,0; 4 -4.5,0 | hole 1.27: -7.5,-1.96; 7.5,-1.96
43650-0316 = drill 1.02: 1 3,0; 2 0,0; 3 -3,0 | hole 1.27: -6,-1.96; 6,-1.96
1017532 = drill 2: 1A 11.96,-10.16; 1B 8.36,-10.16; 2A 1.8,0; 2B -1.8,0; 3A -8.36,-10.16; 3B -11.96,-10.16
22-23-2041 = drill 1 long: 1 -3.81,0; 2 -1.27,0; 3 1.27,0; 4 3.81,0
5566-2 = drill 1.397 square: 1 0,0 | drill 1.397: 2 0,5.5
RESC1608X55(ERJ-0603) = smd 0.9 x 0.979: 1 -0.785,0; 2 0.785,0
TEST = drill 0.508: T 0,0
SOP50P640X120-38 = smd 1.572 x 0.28: 1 -2.872,4.5; 2 -2.872,4; 3 -2.872,3.5; 4 -2.872,3; 5 -2.872,2.5; 6 -2.872,2; 7 -2.872,1.5; 8 -2.872,1; 9 -2.872,0.5; 10 -2.872,0; 11 -2.872,-0.5; 12 -2.872,-1; 13 -2.872,-1.5; 14 -2.872,-2; 15 -2.872,-2.5; 16 -2.872,-3; 17 -2.872,-3.5; 18 -2.872,-4; 19 -2.872,-4.5; 20 2.872,-4.5; 21 2.872,-4; 22 2.872,-3.5; 23 2.872,-3; 24 2.872,-2.5; 25 2.872,-2; 26 2.872,-1.5; 27 2.872,-1; 28 2.872,-0.5; 29 2.872,0; 30 2.872,0.5; 31 2.872,1; 32 2.872,1.5; 33 2.872,2; 34 2.872,2.5; 35 2.872,3; 36 2.872,3.5; 37 2.872,4; 38 2.872,4.5
ACS780 = smd 0.5 x 1.6: 1 -1.6,-2.5; 2 0,-2.5; 3 1.6,-2.5 | smd 0.9 x 0.6: 4 2.8,0; 7 -2.8,0 | smd 1.8 x 1.7: 5 1.5,2.35; 6 -1.5,2.35
SOIC127P1150X280-8 = smd 1.801 x 0.599: 1 -5.33,1.905; 2 -5.33,0.635; 3 -5.33,-0.635; 4 -5.33,-1.905; 5 5.33,-1.905; 6 5.33,-0.635; 7 5.33,0.635; 8 5.33,1.905
SOT65P210X110-5 = smd 1.182 x 0.397: 1 -0.964,0.65; 2 -0.964,0; 3 -0.964,-0.65; 4 0.964,-0.65; 5 0.964,0.65
RFM = drill 0.65 square: 1 0,0 | drill 0.65: 2 2.54,0; 3 5.08,0; 4 7.62,0
SOT65P210X110-3(SOT323) = smd 0.65 x 0.55: 1 -0.9,0.65; 2 -0.9,-0.65; 3 0.9,0
VX78-500 = drill 1: 1 -2.54,0; 2 0,0; 3 2.54,0
SOIC127P1030X265-16 = smd 2.056 x 0.599: 1 -4.642,4.445; 2 -4.642,3.175; 3 -4.642,1.905; 4 -4.642,0.635; 5 -4.642,-0.635; 6 -4.642,-1.905; 7 -4.642,-3.175; 8 -4.642,-4.445; 9 4.642,-4.445; 10 4.642,-3.175; 11 4.642,-1.905; 12 4.642,-0.635; 13 4.642,0.635; 14 4.642,1.905; 15 4.642,3.175; 16 4.642,4.445
SOT127P700X220-4 = smd 1.667 x 0.572: 1 -3.221,1.27; 2 -3.221,-1.27; 3 3.221,-1.27; 4 3.221,1.27
SOT95P280X110-6 = smd 1.25 x 0.589: 1 -1.256,0.95; 2 -1.256,0; 3 -1.256,-0.95; 4 1.256,-0.95; 5 1.256,0; 6 1.256,0.95
MODULE_NUCLEO-F429ZI = drill 1.02 square: CN7_1 21.59,33.914; CN8_1 -24.13,24.77; CN9_1 -24.13,1.91; CN10_1 21.59,6.99 | drill 1.02: CN7_2 24.13,33.914; CN7_3 21.59,31.374; CN7_4 24.13,31.374; CN7_5 21.59,28.834; CN7_6 24.13,28.834; CN7_7 21.59,26.294; CN7_8 24.13,26.294; CN7_9 21.59,23.754; CN7_10 24.13,23.754; CN7_11 21.59,21.214; CN7_12 24.13,21.214; CN7_13 21.59,18.674; CN7_14 24.13,18.674; CN7_15 21.59,16.134; CN7_16 24.13,16.134; CN7_17 21.59,13.594; CN7_18 24.13,13.594; CN7_19 21.59,11.054; CN7_20 24.13,11.054; CN8_2 -21.59,24.77; CN8_3 -24.13,22.23; CN8_4 -21.59,22.23; CN8_5 -24.13,19.69; CN8_6 -21.59,19.69; CN8_7 -24.13,17.15; CN8_8 -21.59,17.15; CN8_9 -24.13,14.61; CN8_10 -21.59,14.61; CN8_11 -24.13,12.07; CN8_12 -21.59,12.07; CN8_13 -24.13,9.53; CN8_14 -21.59,9.53; CN8_15 -24.13,6.99; CN8_16 -21.59,6.99; CN9_2 -21.59,1.91; CN9_3 -24.13,-0.63; CN9_4 -21.59,-0.63; CN9_5 -24.13,-3.17; CN9_6 -21.59,-3.17; CN9_7 -24.13,-5.71; CN9_8 -21.59,-5.71; CN9_9 -24.13,-8.25; CN9_10 -21.59,-8.25; CN9_11 -24.13,-10.79; CN9_12 -21.59,-10.79; CN9_13 -24.13,-13.33; CN9_14 -21.59,-13.33; CN9_15 -24.13,-15.87; CN9_16 -21.59,-15.87; CN9_17 -24.13,-18.41; CN9_18 -21.59,-18.41; CN9_19 -24.13,-20.95; CN9_20 -21.59,-20.95; CN9_21 -24.13,-23.49; CN9_22 -21.59,-23.49; CN9_23 -24.13,-26.03; CN9_24 -21.59,-26.03; CN9_25 -24.13,-28.57; CN9_26 -21.59,-28.57; CN9_27 -24.13,-31.11; CN9_28 -21.59,-31.11; CN9_29 -24.13,-33.65; CN9_30 -21.59,-33.65; CN10_2 24.13,6.99; CN10_3 21.59,4.45; CN10_4 24.13,4.45; CN10_5 21.59,1.91; CN10_6 24.13,1.91; CN10_7 21.59,-0.63; CN10_8 24.13,-0.63; CN10_9 21.59,-3.17; CN10_10 24.13,-3.17; CN10_11 21.59,-5.71; CN10_12 24.13,-5.71; CN10_13 21.59,-8.25; CN10_14 24.13,-8.25; CN10_15 21.59,-10.79; CN10_16 24.13,-10.79; CN10_17 21.59,-13.33; CN10_18 24.13,-13.33; CN10_19 21.59,-15.87; CN10_20 24.13,-15.87; CN10_21 21.59,-18.41; CN10_22 24.13,-18.41; CN10_23 21.59,-20.95; CN10_24 24.13,-20.95; CN10_25 21.59,-23.49; CN10_26 24.13,-23.49; CN10_27 21.59,-26.03; CN10_28 24.13,-26.03; CN10_29 21.59,-28.57; CN10_30 24.13,-28.57; CN10_31 21.59,-31.11; CN10_32 24.13,-31.11; CN10_33 21.59,-33.65; CN10_34 24.13,-33.65 | hole 3.2: -22.86,-37.46; 22.86,-37.46; 24.13,37.47; 8.89,-13.33; -24.13,38.74
SOIC127P1150X265-8N = smd 1.801 x 0.602: 1 -5.33,1.905; 2 -5.33,0.635; 3 -5.33,-0.635; 4 -5.33,-1.905; 5 5.33,-1.905; 6 5.33,-0.635; 7 5.33,0.635; 8 5.33,1.905
SOIC127P1030X265-16N = smd 2.056 x 0.599: 1 -4.642,4.445; 2 -4.642,3.175; 3 -4.642,1.905; 4 -4.642,0.635; 5 -4.642,-0.635; 6 -4.642,-1.905; 7 -4.642,-3.175; 8 -4.642,-4.445; 9 4.642,-4.445; 10 4.642,-3.175; 11 4.642,-1.905; 12 4.642,-0.635; 13 4.642,0.635; 14 4.642,1.905; 15 4.642,3.175; 16 4.642,4.445

### Placement (x,y rotation side)
C1  10.92,86.36 0 top
C2  43.18,98.55 0 top
C3  34.54,13.46 0 top
C4  10.92,84.84 0 top
C5  43.18,97.28 0 top
C6  26.42,18.29 180 top
C7  29.46,18.29 0 top
C8  49.28,13.46 0 top
C9  41.66,17.78 180 top
C10  44.7,17.78 0 top
C11  5.84,15.75 180 top
C12  5.84,14.22 180 top
C13  44.7,102.11 270 top
C14  44.7,107.19 270 top
C15  97.79,26.16 0 top
C16  88.39,20.83 270 top
C17  42.67,111.25 90 top
C18  35.81,112.78 270 top
C19  39.12,90.17 180 top
C20  110.24,102.36 270 top
C21  110.24,106.93 270 top
C22  57.91,95 0 top
C23  80.26,13.72 180 top
C24  73.41,107.44 90 top
C25  71.12,97.54 180 top
C26  105.92,11.43 270 top
C27  35.81,67.06 0 top
C28  35.81,68.33 0 top
C29  37.85,66.04 90 top
C30  57.91,108.71 0 top
C31  36.58,54.86 270 top
C32  34.04,64.77 180 top
C33  33.27,55.63 180 top
C34  28.19,66.29 180 top
C35  30.99,66.29 180 top
C36  29.46,54.61 180 top
C37  33.27,53.59 0 top
C38  103.38,20.83 0 top
C39  96.01,96.77 270 top
C40  103.38,18.29 0 top
C41  96.01,107.44 90 top
C42  74.42,43.69 0 top
C43  -21.08,-1.27 0 top  (outside the outline)
C44  -25.4,-1.27 0 top  (outside the outline)
C45  -30.23,-1.27 0 top  (outside the outline)
C46  -34.29,-1.27 0 top  (outside the outline)
C47  -39.12,-1.27 0 top  (outside the outline)
C48  -43.18,-1.27 0 top  (outside the outline)
C49  -48.01,-1.27 0 top  (outside the outline)
C50  -52.32,-1.27 0 top  (outside the outline)
C51  -56.64,-1.27 0 top  (outside the outline)
C52  -60.96,-16.51 0 top  (outside the outline)
D1  58.17,16.26 180 top
D2  58.17,22.61 0 top
H1  115,60 0 top
H2  5,60 0 top
H3  5,47.5 0 top
H4  5,72.5 0 top
H5  115,47.5 0 top
H6  115,72.5 0 top
J1  11.94,6.6 0 top
J2  29.46,6.6 0 top
J3  44.7,6.6 0 top
J4  58.42,6.6 0 top
J5  76.96,6.6 0 top
J6  63.5,114.55 180 top
J7  80.52,114.3 180 top
J8  98.81,114.3 180 top
J9  16.76,113.03 0 top
J10  63.25,17.78 270 top
POWER  113.79,8.89 0 top
R1  26.42,16.26 180 top
R2  29.46,16.26 0 top
R3  26.42,14.48 180 top
R4  29.46,14.48 0 top
R5  41.66,16 180 top
R6  44.7,16 0 top
R7  41.66,14.48 180 top
R8  44.7,14.48 0 top
R9  38.35,96.01 270 top
R10  39.88,96.01 270 top
R11  36.83,92.71 270 top
R12  41.4,91.95 90 top
R13  34.04,114.55 90 top
R14  38.1,112.78 90 top
R15  74.17,11.68 180 top
R16  71.12,11.68 180 top
R17  77.22,11.68 180 top
R18  79.5,28.19 180 top
R19  85.72,109.22 0 top
R20  79.88,109.22 0 top
R21  82.8,109.22 0 top
R22  71.12,99.06 180 top
R23  28.96,68.33 270 top
R24  27.43,68.33 270 top
R25  31.75,68.33 270 top
R26  30.23,68.33 270 top
R27  30.23,52.58 90 top
R28  28.7,52.58 90 top
R29  58.17,20.83 180 top
R30  58.17,19.3 0 top
R31  58.17,17.78 0 top
R32  74.42,40.64 0 top
R33  74.42,42.16 180 top
R34  -14.99,-2.03 0 top  (outside the outline)
R35  -54.86,-5.84 0 top  (outside the outline)
R36  -54.86,-9.65 0 top  (outside the outline)
R37  -54.86,-13.46 0 top  (outside the outline)
R38  -54.86,-17.27 0 top  (outside the outline)
T1  31.5,54.61 0 top
T2  33.02,67.56 0 top
U1  34.04,60.2 270 top
U2  11.68,90.68 0 top
U3  39.12,104.39 270 top
U4  39.12,92.71 270 top
U5  50.8,100.58 90 top
U6  99.31,22.35 180 top
U7  40.39,112.78 0 top
U8  7.87,18.29 180 top
U9  22.35,11.68 180 top
U10  37.59,11.68 180 top
U11  69.34,14.22 180 top
U12  116.59,101.09 90 top
U13  69.6,108.71 180 top
U14  98.3,10.92 90 top
U15  76.45,20.57 270 top
U16  79.25,101.85 90 top
U17  76.71,109.47 180 top
U18  12.45,19.81 270 top
U19  17.27,19.81 270 top
U20  70.1,104.65 270 top
U21  61.72,101.85 90 top
U22  60,60 270 top
U23  100.33,102.62 90 top
U24  -12.7,7.62 0 top  (outside the outline)

### Tracks (layer width: path | path; a pad name or v marks a point on that pad's centre or on a via)
12V_SENSE
  Top 0.254: C42.1 R33.2 R32.1 73.64,38.45 U22.CN7_17
+5V  (via drill 0.35)  (3 unrouted)
  Top 0.254: J2.2 30.21,13.46 | 30.21,13.46 30.21,14.44 R4.2 | C3.1 30.21,13.46 | J3.2 45.45,13.46 | 45.45,13.46 45.45,14.44 R8.2 | C8.1 45.45,13.46 | U1.30 34.54,56.11 C33.1
  Top 0.305: C15.1 96.77,26.16 | C32.1 34.54,64.49 U1.9 U1.30
  Top 0.406: R3.2 23.11,14.48 22.35,13.72 22.35,9.65 22.86,9.14 25.95,9.14 26.46,8.64 32.51,8.64 33.02,9.14 37.59,9.14 37.59,14.48 | R7.2 37.59,14.48 | 37.59,14.48 34.78,14.48 C3.1
  Top 0.508: C8.1 48.5,9.38 48.01,8.89 41.15,8.89 40.89,9.14 37.59,9.14 | U5.2 50.68,103.01 C13.1 | U22.CN8_9 75.95,82.79 75.95,80.01 73.91,77.98 54.36,77.98 53.34,76.96 v51.56,76.96 | v38.1,76.96 37.34,76.96 34.04,73.66 34.04,66.57 34.82,65.79 C32.1 | v52.58,98.3 52.58,90.17 48.01,85.6 v48.01,76.96
  Top 0.813: U22.CN8_9 74.61,85.15 77.6,88.14 105.16,88.14 105.41,88.39 | U12.2 116.22,103.26 C20.1 108.34,103.26 105.41,100.33 105.41,88.39 | 98.04,31.24 96.77,29.97 96.77,26.16 U6.2 | 98.04,31.24 105.41,38.61 105.41,88.39 | 98.04,31.24 v60.45,31.24 | v54.1,24.89 48.5,19.29 C8.1
  Bottom 0.508: v51.56,76.96 v48.01,76.96 v38.1,76.96 | U5.2 51.82,103.12 52.58,102.36 v52.58,98.3
  Bottom 0.813: v60.45,31.24 v54.1,24.89
  pour Top: 96.52,23.37 96.52,12.19 103.38,12.19 103.38,23.37
+12V  (via drill 0.35)
  Top 0.254: R31.2 61.98,17.78 J10.2 | R32.2 75.97,40.64 77.49,39.12 77.49,34.82 v77.47,34.8 | v77.47,30.23 95.25,30.23 95.76,29.72 95.76,10.92 U14.1
  Top 0.406: J10.2 64.77,19.05 65.79,18.03 65.79,1.52
  Top 0.508: C26.1 106.28,14.39 109.73,14.39
  Top 0.61: C11.1 C12.1 6.62,13.22 J1.6
  Top 0.813: J1.6 8.19,4 10.67,1.52 65.79,1.52 105.92,1.52 108.2,3.81 108.2,14.39
  Top 1.27: U14.1 100.08,8.38 106.08,14.39 108.2,14.39 109.73,14.39 POWER.2
  Bottom 0.254: v77.47,34.8 v77.47,30.23
ABSORBER_485_A
  Top 0.254: J5.3 75.44,6.63 75.44,11.43 75.18,11.68 | 75.18,11.68 R15.1 | 75.18,11.68 R17.2 76.43,12.93 77.72,14.22 77.72,17.02 77.22,17.53 76.2,17.53 75.82,17.14 U15.12 75.82,14.61 75.44,14.22 70.89,14.22 U11.2
ABSORBER_485_B
  Top 0.254: 72.64,11.68 R16.1 71.91,12.93 71.26,13.57 U11.1 | 72.64,11.68 R15.2 73.38,12.42 73.91,12.95 75.44,12.95 77.09,14.61 U15.13 | J5.4 72.46,11.5 72.64,11.68
AIN_3P
  Top 0.254: U1.23 31.04,55.07 T1.T 32.26,53.85 32.49,53.61 C37.1
ANALOG_OUT  (1 unrouted)
  Top 0.254: U13.4 64.39,109.36 J6.2
AUX_IN
  Top 0.305: U1.10 34.04,65.53 33.02,66.55 T2.T
CANH
  Top 0.254: U23.7 99.69,107.06 99.99,106.77 101.38,106.77 101.66,107.04 101.66,114.15 J8.3
CANL
  Top 0.254: U23.6 100.97,112.14 J8.2
CCW_CAL
  Top 0.254: J1.2 14.19,13.43 15.75,14.99 17.7,14.99 18.54,15.83 U19.4
CW_CAL
  Top 0.254: J1.3 12.69,13.2 13.72,14.22 U18.4
DUT_485_A
  Top 0.254: J7.3 R21.1 R20.2 | U16.12 79.88,108.44 R20.2 | R20.2 79.76,110.12 U17.2
DUT_485_B
  Top 0.254: J7.4 84.94,114.22 R19.1 R21.2 82.43,108.06 80.99,108.06 80.57,107.64 80.57,105.46 80.01,104.9 78.99,104.9 78.61,105.28 U16.13 78.61,107.82 U17.1
ENC_A
  Top 0.254: R5.1 R7.1 42.44,12.19 | 42.44,12.19 42.44,11.67 J3.4 | U10.2 42.3,12.33 42.44,12.19
ENC_B
  Top 0.254: R6.1 R8.1 43.92,11.69 J3.3 43.95,10.43 43.43,9.91 41.66,9.91 40.53,11.03 U10.1
GND  (via drill 0.35)  (76 unrouted)
  Top 0.254: U10.3 36.18,12.19 v35.56,12.19 35.56,13.23 C3.2 | J2.1 31.75,11.62 v31.75,9.65 | C7.2 30.24,18.56 v30.99,19.3 | C6.2 25.64,19.54 v25.65,19.56 | U9.3 v20.32,11.68 | J1.1 15.75,11.59 v15.75,9.65 | C11.2 C12.2 5.08,14.21 v5.08,13.21 | U8.3 6.97,18.93 v6.6,19.3 | U18.2 v11.18,24.64 | U19.2 v16,24.64 | v71.37,27.18 72.01,26.54 U15.8 U15.7 | v79.76,26.92 79.63,26.8 U15.2 | J3.1 46.95,9.94 v46.99,9.91 | C8.2 v51.31,13.46 | C9.2 40.88,18.78 v40.89,18.8 | C10.2 45.48,18.78 v45.47,18.8 | U21.2 58.55,95.14 C22.2 58.69,94.51 58.67,94.49 v58.67,93.98 | U21.8 66.17,97.03 | 66.17,97.03 66.17,95.63 v66.29,95.5 | U21.7 65.98,97.21 66.17,97.03 | C25.2 v69.34,97.54 | U23.4 102.23,96.14 v102.62,95.76 | C39.2 v96.01,94.74 | U16.2 76.07,95.89 v75.69,95.5 | v83.57,95.5 83.69,95.63 U16.8 U16.7 | 34.29,53.59 C37.2 34.05,53.61 35.55,55.11 | U1.28 33.54,58.68 v33.78,58.93 | U1.29 U1.28 | U1.3 U1.4 | U1.6 36.04,66.5 C27.2 C28.2 | C29.2 37.85,67.84 37.36,68.33 C28.2 | v37.59,68.33 C28.2 | C33.2 33.13,56.26 33.29,56.26 33.54,56.51 U1.28 | U1.22 30.54,58.36 v30.23,58.67 | U1.33 U1.32 | U1.32 U1.31 | U1.32 35.56,57.35 v35.56,58.93 | U1.32 35.54,55.12 35.55,55.11 | 35.55,55.11 C31.2 | v37.34,90.17 C19.2 39.12,90.95 39.12,92.71 | U4.2 39.12,92.71 | R12.1 v41.4,90.17 | R26.1 30.23,75.18 32.77,77.72 32.77,89.41 36.07,92.71 39.12,92.71 | C4.2 13.72,84.84 27.43,71.12 | C4.2 C1.2 11.68,86.38 U2.2 | C4.2 11.7,83.58 v11.68,83.57 | J10.1 62.48,20.83 R29.1 58.95,22.34 D2.2 | D1.2 57.4,16.26 v58.17,15.49 | R33.1 C42.2 75.18,43.71 75.18,44.7 v75.18,44.96
  Top 0.305: U1.11 33.54,64.49 C32.2 v31.75,64.77 | U1.8 35.04,61.99 35.31,61.72 v36.07,61.72 | U1.6 36.04,61.75 v36.07,61.72 | U1.4 37.04,61.93 36.83,61.72 v36.07,61.72
  Top 0.406: C40.2 104.16,18.41 C38.2 104.16,21.08 102.89,22.35 U6.1 99.31,25.54 C15.2
  Top 0.508: U5.1 50.18,101.21 C13.2 37.71,101.21 37.21,100.71 U3.5 | C2.2 C5.2 v45.21,97.28
  Top 0.61: C26.2 v105.92,5.33
  Top 0.813: C20.2 116.22,101.46 U12.1
  other vias: 7.11,90.93 6.1,90.93 5.08,90.93 4.06,90.93 3.05,90.93 2.03,90.93 16,90.93 17.02,90.93 18.03,90.93 19.05,90.93 20.07,90.93 21.08,90.93
  pour Bottom (rank 2): 0,0 0,120.14 33.27,120.14 33.27,101.6 51.82,101.6 51.82,98.04 114.3,98.55 114.3,102.11 120.14,102.11 120.14,0 96.52,0 96.52,24.13 66.8,24.13 66.8,0
  pour Top: 0,91.44 22.1,91.44 22.1,82.8 0,82.8
  pour Top: 29.21,63.5 39.12,63.5 39.12,57.15 29.21,57.15
ISENSE_OUT  (1 unrouted)
  Top 0.254: R23.1 28.96,70.61 13.28,86.28 U2.3
ISO_5V_485
  pour Top: 68.07,17.53 87.38,17.53 87.38,23.37 95.25,23.37 95.25,2.29 68.07,2.29
ISO_5V_DUT  (13 unrouted)
  pour Top: 53.85,120.14 119.89,120.14 119.89,104.9 120.14,104.65 53.85,104.65
ISO_5V_M
  pour Top: 34.8,119.89 52.07,119.89 52.07,104.9 45.97,104.9 45.97,107.95 34.8,107.95
ISO_GND_485  (via drill 0.35)
  Top 0.254: U15.15 79.63,13.86 C23.2 | 79.48,13.17 C23.2 | C23.2 79.48,11.96 | 79.48,11.96 v79.5,11.94 | R17.1 79.21,11.68 79.48,11.96 | C16.2 v88.39,18.54
  Top 0.305: U15.10 U15.9 71.19,15.93 v70.87,16.26 | U11.3 68.44,13.35 v68.58,13.21
  pour Bottom: 68.07,17.53 87.38,17.53 87.38,23.37 95.25,23.37 95.25,1.02 68.07,1.02
ISO_GND_DUT  (via drill 0.35)  (15 unrouted)
  Top 0.254: v62.74,111.76 62.74,109.52 J6.1 62.74,109.49 62.74,108.71 63.63,107.82 U21.11 | U21.15 58.55,108.57 C30.2 v59.69,108.71 | U21.9 66.17,108.08 v66.29,108.2 | U20.2 70.1,106.93 v69.85,107.19 | U16.15 76.07,109.21 U17.3 | U17.3 v74.68,109.47 74.66,109.47 C24.2 | U17.3 78.84,109.47 R20.1 | v84.58,107.95 84.07,107.95 83.69,107.57 U16.9 U16.10 | U23.5 102.23,109.09 v102.62,109.47 | C41.2 v96.01,109.47
  Top 0.813: U12.3 116.45,106.03 C21.2
  pour Bottom: 53.85,120.14 119.89,120.14 119.89,104.65 53.85,104.65
ISO_GND_M  (via drill 0.35)
  Top 0.508: C14.2 47.38,106.29 48.01,105.66 U5.3 | U7.3 41.93,112.78 C17.2 44.18,112.03 v44.2,112.01 | U3.4 v36.07,109.72 v36.07,109.73
  pour Bottom: 34.8,107.95 45.97,107.95 45.97,104.9 52.07,104.9 52.07,119.89 34.8,119.89
MOTOR_POWER_GND
  Top 0.254: U3.3 38.48,111.61 R14.1 | U7.2 38.23,112.13 R14.1 | R14.1 35.93,111.99 C18.2 30.09,111.88 28.7,110.49 28.7,102.89 J9.1A
  Top 0.508: J9.1B J9.1A
MOTOR_POWER_IN
  pour Top (rank 2, no thermals): 11.94,91.95 11.94,118.87 11.94,120.14 22.1,120.14 22.1,91.95
MOTOR_POWER_OUT
  Top 0.254: R13.2 30.73,118.64 10.95,118.64 8.38,116.08 8.38,103.63 8.64,103.38 8.64,103.1 J9.3A
  pour Top (no thermals): 0.25,119.89 11.43,119.89 11.43,91.95 0.25,91.95
N$1
  Top 0.254: J10.3 62.48,16.51 61.98,17.01 58.38,17.01 57.62,17.78 | 57.62,17.78 R31.1 | R30.2 57.62,17.97 57.62,17.78
N$2  (2 unrouted)
N$3
  Top 0.254: R10.2 39.77,95.11 U4.1 40.46,93.67 R12.2
N$4
  Top 0.254: R9.2 38.47,95.11 U4.3 37.01,93.67 R11.1
N$5  (2 unrouted)
N$6
  Top 0.254: R26.2 30.21,67.52 C35.2 30.23,66.29 30.54,65.98 U1.17
N$9
  Top 0.254: R25.2 31.77,67.52 C35.1 31.04,65.56 U1.16
N$10
  Top 0.254: U3.7 39.75,96.92 R10.1
N$11  (1 unrouted)
  Top 0.254: U20.1 71.05,107.57
N$12
  Top 0.254: U21.14 59.82,105.54 61.21,104.14 67.56,104.14 67.92,103.78 67.92,102.45 68.41,101.96 70.27,101.96 70.93,102.61 70.93,103.27 U20.6
N$13
  Top 0.254: U21.13 61.09,105.28 61.72,104.65 67.82,104.65 68.33,104.14 68.33,102.62 68.58,102.36 69.85,102.36 70.1,102.62 U20.5
N$14
  Top 0.254: U21.12 62.36,105.54 62.74,105.16 68.33,105.16 69.15,104.33 U20.4
N$15
  Top 0.254: U3.6 38.48,96.92 R9.1
N$16
  Top 0.254: R23.2 28.97,67.52 C34.1 28.96,66.28 28.96,65.79 30.04,64.71 U1.18
N$17
  Top 0.254: R24.2 27.41,67.52 C34.2 29.54,64.17 U1.19
N$18  (2 unrouted)
N$19  (6 unrouted)
N$20  (2 unrouted)
N$21  (1 unrouted)
N$22  (2 unrouted)
N$23  (2 unrouted)
PA0_FAN_PWM  (via drill 0.35)
  Top 0.254: J10.4 61.98,13.97 59.69,16.26 D1.1 58.17,16.26 57.41,17.01 56.81,17.01 56.81,17.02 56.64,17.02 56.39,17.27 56.39,27.94 v53.09,31.24 | v40.89,33.53 43.69,33.53 45.97,31.24 v49.02,31.24
  Bottom 0.254: U22.CN10_29 32.7,37.14 32.7,34.86 34.04,33.53 v40.89,33.53 | v53.09,31.24 v49.02,31.24
PA5_SPI1_SCK
  Top 0.254: U22.CN7_10 85.09,37.21 85.09,39.62 69.85,54.86 39.37,54.86 38.04,56.2 U1.37
PA6_SPI1_MISO
  Top 0.254: U22.CN7_12 82.55,37.21 82.55,40.89 69.09,54.36 39.12,54.36 37.54,55.94 U1.36
PB3_FAN_TACH  (via drill 0.35)
  Top 0.254: R30.1 R29.2 57.38,22.34 D2.1 57.12,23.59 v61.47,27.94 | v74.42,32.51 v61.98,32.51
  Bottom 0.254: U22.CN7_15 74.93,37.21 74.93,33.02 v74.42,32.51 | v61.98,32.51 61.98,28.45 v61.47,27.94
PB5_SPI1_MOSI  (via drill 0.35)
  Top 0.254: U22.CN7_13 78.67,43.49 v68.58,53.58 v68.58,53.59 | v66.04,56.13 40.13,56.13 39.12,57.15 39.12,60.71 38.54,61.29 U1.1
  Bottom 0.254: v68.58,53.59 v66.04,56.13
PB10_SPI2_SCK  (via drill 0.35)
  Top 0.254: U21.4 61.09,90.3 58.93,88.14 53.59,88.14 50.55,85.09 v50.55,56.9 | v50.55,53.59 50.55,49.53 43.69,42.67 32.51,42.67 30.23,40.39 30.23,37.97 28.89,36.63 U22.CN10_32
  Bottom 0.254: v50.55,56.9 v50.55,53.59
PB11_CW_CAL
  Top 0.254: U18.1 13.72,23.93 25.66,35.87 U22.CN10_34
PB12_SPI1_CS_ADC
  Top 0.254: U1.38 38.54,56.46 39.62,55.37 70.36,55.37 86.29,39.44 U22.CN7_7
PB15_SPI2_MOSI  (via drill 0.35)
  Top 0.254: U21.5 62.36,90.3 v64.01,88.65 | v64.01,76.96 64.01,65.78 U22.CN7_3
  Bottom 0.254: v64.01,88.65 v64.01,76.96
PC6_TIM3_CH1  (via drill 0.35)
  Top 0.254: R1.2 27.2,17.82 C6.1 32.77,23.86 32.77,39.37 35.31,41.91 67.31,41.91 v69.09,40.13 | U22.CN7_1 92.71,37.21 92.71,34.29 91.69,33.27 69.85,33.27 v69.09,34.04
  Bottom 0.254: v69.09,34.04 v69.09,40.13
PC7_TIM3_CH2
  Top 0.254: R2.2 28.68,17.82 C7.1 35.31,24.91 35.31,38.86 37.59,41.15 66.8,41.15 68.33,39.62 68.33,36.32 70.61,34.04 78.74,34.04 80.01,35.31 80.01,37.34 81.08,38.41 U22.CN7_11
PD0_CAN1_RX  (via drill 0.35)
  Top 0.254: U23.3 100.97,95.12 97.28,91.44 78.99,91.44 73.41,85.85 73.41,80.77 71.37,78.74 53.85,78.74 53.59,78.49 51.82,78.49 v51.56,78.74
  Bottom 0.254: U22.CN9_25 32.77,82.8 32.77,80.52 34.54,78.74 v51.56,78.74
PD1_CAN1_TX  (via drill 0.35)
  Top 0.254: U23.2 99.69,95.12 96.77,92.2 78.49,92.2 70.87,84.58 70.87,80.77 69.34,79.25 v53.34,79.25
  Bottom 0.254: U22.CN9_27 29.15,84.13 30.23,83.06 30.23,80.52 32.77,77.98 51.82,77.98 53.09,79.25 v53.34,79.25
PD4_USART2_DE
  Top 0.254: U22.CN9_8 55.63,82.93 55.63,85.09 57.15,86.61 69.34,86.61 78.61,95.89 U16.4 U16.5
PD5_USART2_TX
  Top 0.254: U22.CN9_6 58.17,82.93 58.17,85.09 58.93,85.85 69.6,85.85 78.74,95 80.01,95 81.15,96.14 U16.6
PD6_USART2_RX
  Top 0.254: U22.CN9_4 57.79,80.01 53.85,80.01 53.09,80.77 53.09,85.34 55.12,87.38 69.09,87.38 77.34,95.63 U16.3 77.34,98.68 76.96,99.06 R22.1
PD13_LED_GREEN
  Top 0.305: U22.CN10_19 45.47,37.07 45.47,34.54 46.99,33.02 50.04,33.02 55.63,27.43 55.63,16.47 59.17,12.92 J4.1
PE0_CCW_CAL
  Top 0.254: U22.CN10_33 27.43,37.33 27.43,34.8 18.54,25.91 U19.1
PE6_ADC_RST
  Top 0.254: U1.2 38.04,63.94 39.05,64.96 U22.CN9_20
PE7_LED_RED
  Top 0.305: U22.CN10_20 44.13,34.61 46.48,32.26 49.28,32.26 54.88,26.66 54.88,15.97 57.67,13.18 J4.2
PE8_USART6_DE
  Top 0.254: U22.CN10_18 47.88,37.08 55.12,37.08 55.63,36.58 55.63,33.27 58.67,30.23 72.39,30.23 75.82,26.8 U15.5 U15.4
PE9_TIM1_CH1
  Top 0.254: R5.2 42.44,17.57 C9.1 42.44,26.4 37.85,30.99 37.85,39.12 39.12,40.39 61.98,40.39 63.18,39.18 63.18,37.14 U22.CN10_4
PE11_TIM1_CH2
  Top 0.254: R6.2 43.92,17.57 C10.1 43.92,27.7 40.13,31.5 40.13,39.12 40.89,39.88 59.94,39.88 60.71,39.12 60.71,37.07 U22.CN10_6
PF10_SPI2_CS_ANA
  Top 0.254: U22.CN9_11 49.21,85.02 53.09,88.9 57.66,88.9 59.82,91.06 U21.3
PG9_USART6_RX
  Top 0.254: U22.CN10_16 49.97,35.87 56.89,28.96 66.04,28.96 71.37,23.62 77.47,23.62 78.36,24.51 U15.3 78.36,27.84 R18.2
PG14_USART6_TX
  Top 0.254: U22.CN10_14 51.75,35.62 57.83,29.53 71.5,29.53 74.55,26.49 U15.6
REFCAP
  Top 0.254: U1.7 35.54,66.55 C27.1 C28.1
REFIO
  Top 0.254: U1.5 36.54,63.95 C29.1
SENSE_VOLTAGE
  Top 0.254: R13.1 35.72,113.77 C18.1 35.93,113.56 R14.2 38.23,113.43 U7.1 39.74,113.43 40.13,113.03 40.13,111.51 39.75,111.12 U3.2
SPEED_A
  Top 0.254: R1.1 R3.1 27.21,14.46 27.21,12.19 | J2.4 27.21,12.19 | U9.2 27.07,12.33 27.21,12.19
SPEED_B
  Top 0.254: R2.1 R4.1 28.68,11.69 J2.3 28.71,10.68 27.94,9.91 26.67,9.91 25.54,11.03 U9.1
TAF
  Top 0.305: R27.2 30.23,54.59 C36.1 30.04,54.82 U1.21
TGF
  Top 0.305: U1.20 29.54,55.46 C36.2 28.68,53.38 R28.2
TORQUE_ANALOG
  Top 0.305: R27.1 30.23,50.04 7.92,27.73 7.92,18.5 U8.1 9.69,16.72 J1.5
TORQUE_GROUND
  Top 0.254: J1.4 11.18,11.67 | 9.76,18.94 9.91,18.8
  Top 0.305: 11.18,11.67 U18.3 11.18,17.53 10.54,18.16 | 10.54,18.16 9.91,18.8 9.91,28.7 31.24,50.04 31.24,52.15 30.84,52.55 29.61,52.55 28.86,51.79 R28.1 | U8.2 9.76,18.94 | U19.3 14.43,18.16 10.54,18.16
VCC  (via drill 0.35)
  Top 0.254: U15.1 80.9,28.09 80.8,28.19 R18.1 | 57.28,95.14 C22.1 | 98.16,97.55 U23.1 | C25.1 71.88,97.54 71.86,97.54 | U1.34 36.54,55.68 C31.1 | U4.5 39.77,90.3 C19.1 | U2.1 10.14,88.12 C1.1 C4.1
  Top 0.356: U1.34 36.54,58.38 36.83,58.67 v38.35,58.67 | R18.1 85.85,28.19 86.87,29.21 v86.87,29.46
  Top 0.508: 57.28,95.14 U21.1 57.28,98.68 | 98.16,97.55 C39.1 95.27,97.55 90.7,92.99 78,92.99 v74.42,89.41 | 71.86,97.54 R22.2 57.66,99.06 57.28,98.68 | C25.1 74.48,97.54 U16.1 | U22.CN8_7 78.49,82.79 78.49,52.58 v87.38,43.69 | v71.88,91.95 71.88,97.54 | 42.42,99.57 45.47,99.57 45.72,99.31 56.64,99.31 57.28,98.68 | 42.42,99.57 41.02,99.57 U3.8 | 42.42,99.57 42.4,99.55 C2.1 C5.1 42.4,89.9 41.89,89.39 40.43,89.39 40.39,89.43 | 40.39,89.43 39.9,89.92 C19.1 | 40.39,89.43 40.39,88.14 | 40.39,88.14 40.39,59.44 v39.88,58.93 | U2.1 10.08,90.86 10.95,91.72 21.41,91.72 21.43,91.69 32.26,91.69 v33.02,90.93 | v36.07,88.14 40.39,88.14
  Bottom 0.508: U22.CN8_7 77.15,86.68 v74.42,89.41 v71.88,91.95 | v39.88,58.93 39.62,58.67 v38.35,58.67 | v87.38,43.69 87.48,43.58 87.48,30.08 v86.87,29.46 | v33.02,90.93 35.81,88.14 v36.07,88.14
VSENSE_OUT
  Top 0.254: U4.4 38.29,91.92 R11.2 35.31,90.4 35.31,77.72 31.75,74.17 R25.1

### Text on the board
tNames: DUT: ANALOG | DUT: RS-485 | DUT: CAN | POWER IN / 12V 2A | TORQUE SENSOR | ABSORBER / SPEED | ALTERNATE / ENCODER | STATUS / LED | ABSORBER / RS-485